# Altium project R100.230.030.000-00 ControlVR.PrjPcb (part 1 of 2)
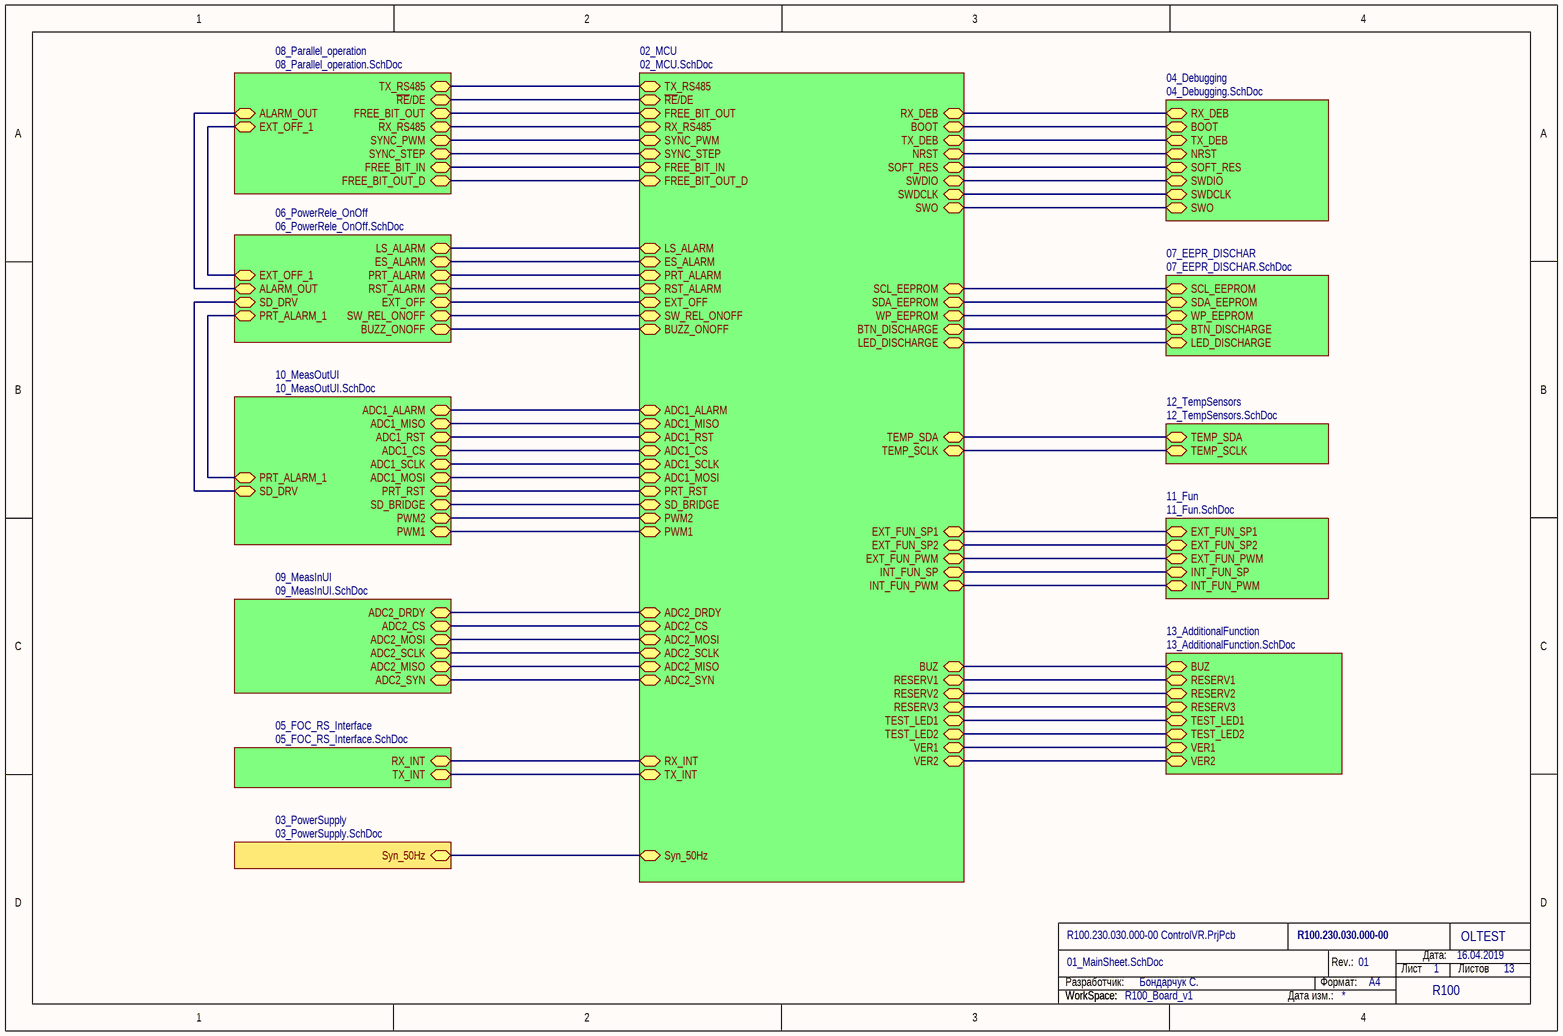
[diagram p0: 01_MainSheet.SchDoc]
13 sheets, 497 parts. Net scope: hierarchical (ports join the sheet entries above them; power ports are global).
Board file: R100.230.030.001-00 ControlVR.PcbDoc
Sheets:
  01_MainSheet.SchDoc
    02_MCU = 02_MCU.SchDoc
    03_PowerSupply = 03_PowerSupply.SchDoc
    04_Debugging = 04_Debugging.SchDoc
    05_FOC_RS_Interface = 05_FOC_RS_Interface.SchDoc
    06_PowerRele_OnOff = 06_PowerRele_OnOff.SchDoc
    07_EEPR_DISCHAR = 07_EEPR_DISCHAR.SchDoc
    08_Parallel_operation = 08_Parallel_operation.SchDoc
    09_MeasInUI = 09_MeasInUI.SchDoc
    10_MeasOutUI = 10_MeasOutUI.SchDoc
    11_Fun = 11_Fun.SchDoc
    12_TempSensors = 12_TempSensors.SchDoc
    13_AdditionalFunction = 13_AdditionalFunction.SchDoc

## Sheet 01_MainSheet.SchDoc
size A4; Organization: OLTEST; Revision: 01; SheetNumber: 1; SheetTotal: 13; Название листа: Название листа; Разработчик: Бондарчук С.; Прибор: R100; АМАК.000000.000 Э3: R100.230.030.000-00; Дата: 16.04.2019; Формат: A4; WorkspaceName: R100_Board_v1; PageSetup: Record=PageOptions|CenterHorizontal=True|CenterVertical=True|PrintScale=0.97|XCorrection=1.00|YCorrection=1.00|PrintKind=0|BorderSize=5000000|LeftOffset=0|BottomOffset=0|Orientation=2|PaperLength=1000|PaperWidth=1000|Scale=100|PaperSource=7|PrintQuality=-3|MediaType=1|DitherType=10|PrintScaleMode=1|PaperKind=A4|PaperIndex=9

### Sub-sheets
02_MCU = 02_MCU.SchDoc: SWO, SOFT_RES, TX_INT, PRT_ALARM, WP_EEPROM, SWDCLK, TX_RS485, LS_ALARM, SCL_EEPROM, SW_REL_ONOFF, ES_ALARM, NRST, RST_ALARM, RX_INT, RX_DEB, Syn_50Hz, BOOT, SDA_EEPROM, SWDIO, TX_DEB, SYNC_PWM, INT_FUN_SP, ADC1_MISO, TEMP_SDA, VER2, LED_DISCHARGE, RX_RS485, ADC1_MOSI, ADC2_MOSI, EXT_FUN_SP2, ADC1_ALARM, FREE_BIT_IN, VER1, ADC2_CS, TEST_LED2, BUZ, ADC1_RST, ADC2_SYN, SD_BRIDGE, ADC1_SCLK, TEST_LED1, PWM1, BUZZ_ONOFF, ADC2_SCLK, EXT_FUN_SP1, ADC1_CS, BTN_DISCHARGE, RESERV2, EXT_OFF, PWM2, ADC2_MISO, RESERV1, EXT_FUN_PWM, TEMP_SCLK, PRT_RST, RESERV3, FREE_BIT_OUT, ~{RE}/DE, INT_FUN_PWM, ADC2_DRDY, SYNC_STEP, FREE_BIT_OUT_D
03_PowerSupply = 03_PowerSupply.SchDoc: Syn_50Hz
04_Debugging = 04_Debugging.SchDoc: SWDIO, TX_DEB, RX_DEB, SWO, SWDCLK, BOOT, SOFT_RES, NRST
05_FOC_RS_Interface = 05_FOC_RS_Interface.SchDoc: RX_INT, TX_INT
06_PowerRele_OnOff = 06_PowerRele_OnOff.SchDoc: PRT_ALARM_1, LS_ALARM, ES_ALARM, PRT_ALARM, RST_ALARM, SW_REL_ONOFF, ALARM_OUT, BUZZ_ONOFF, EXT_OFF, SD_DRV, EXT_OFF_1
07_EEPR_DISCHAR = 07_EEPR_DISCHAR.SchDoc: SCL_EEPROM, SDA_EEPROM, WP_EEPROM, BTN_DISCHARGE, LED_DISCHARGE
08_Parallel_operation = 08_Parallel_operation.SchDoc: ~{RE}/DE, FREE_BIT_OUT, TX_RS485, ALARM_OUT, RX_RS485, SYNC_PWM, SYNC_STEP, FREE_BIT_IN, EXT_OFF_1, FREE_BIT_OUT_D
09_MeasInUI = 09_MeasInUI.SchDoc: ADC2_CS, ADC2_MOSI, ADC2_DRDY, ADC2_SCLK, ADC2_MISO, ADC2_SYN
10_MeasOutUI = 10_MeasOutUI.SchDoc: SD_BRIDGE, ADC1_RST, ADC1_ALARM, PRT_RST, ADC1_MISO, PRT_ALARM_1, ADC1_SCLK, ADC1_CS, ADC1_MOSI, PWM2, PWM1, SD_DRV
11_Fun = 11_Fun.SchDoc: EXT_FUN_PWM, EXT_FUN_SP1, EXT_FUN_SP2, INT_FUN_SP, INT_FUN_PWM
12_TempSensors = 12_TempSensors.SchDoc: TEMP_SCLK, TEMP_SDA
13_AdditionalFunction = 13_AdditionalFunction.SchDoc: RESERV3, RESERV2, VER2, BUZ, RESERV1, VER1, TEST_LED1, TEST_LED2

### Nets
~{RE}/DE: sheet 02_MCU/~{RE}/DE, sheet 08_Parallel_operation/~{RE}/DE
ADC1_ALARM: sheet 02_MCU/ADC1_ALARM, sheet 10_MeasOutUI/ADC1_ALARM
ADC1_CS: sheet 02_MCU/ADC1_CS, sheet 10_MeasOutUI/ADC1_CS
ADC1_MISO: sheet 02_MCU/ADC1_MISO, sheet 10_MeasOutUI/ADC1_MISO
ADC1_MOSI: sheet 02_MCU/ADC1_MOSI, sheet 10_MeasOutUI/ADC1_MOSI
ADC1_RST: sheet 02_MCU/ADC1_RST, sheet 10_MeasOutUI/ADC1_RST
ADC1_SCLK: sheet 02_MCU/ADC1_SCLK, sheet 10_MeasOutUI/ADC1_SCLK
ADC2_CS: sheet 02_MCU/ADC2_CS, sheet 09_MeasInUI/ADC2_CS
ADC2_DRDY: sheet 02_MCU/ADC2_DRDY, sheet 09_MeasInUI/ADC2_DRDY
ADC2_MISO: sheet 02_MCU/ADC2_MISO, sheet 09_MeasInUI/ADC2_MISO
ADC2_MOSI: sheet 02_MCU/ADC2_MOSI, sheet 09_MeasInUI/ADC2_MOSI
ADC2_SCLK: sheet 02_MCU/ADC2_SCLK, sheet 09_MeasInUI/ADC2_SCLK
ADC2_SYN: sheet 02_MCU/ADC2_SYN, sheet 09_MeasInUI/ADC2_SYN
ALARM_OUT: sheet 06_PowerRele_OnOff/ALARM_OUT, sheet 08_Parallel_operation/ALARM_OUT
BOOT: sheet 02_MCU/BOOT, sheet 04_Debugging/BOOT
BTN_DISCHARGE: sheet 02_MCU/BTN_DISCHARGE, sheet 07_EEPR_DISCHAR/BTN_DISCHARGE
BUZ: sheet 02_MCU/BUZ, sheet 13_AdditionalFunction/BUZ
BUZZ_ONOFF: sheet 02_MCU/BUZZ_ONOFF, sheet 06_PowerRele_OnOff/BUZZ_ONOFF
ES_ALARM: sheet 02_MCU/ES_ALARM, sheet 06_PowerRele_OnOff/ES_ALARM
EXT_FUN_PWM: sheet 02_MCU/EXT_FUN_PWM, sheet 11_Fun/EXT_FUN_PWM
EXT_FUN_SP1: sheet 02_MCU/EXT_FUN_SP1, sheet 11_Fun/EXT_FUN_SP1
EXT_FUN_SP2: sheet 02_MCU/EXT_FUN_SP2, sheet 11_Fun/EXT_FUN_SP2
EXT_OFF: sheet 02_MCU/EXT_OFF, sheet 06_PowerRele_OnOff/EXT_OFF
EXT_OFF_1: sheet 06_PowerRele_OnOff/EXT_OFF_1, sheet 08_Parallel_operation/EXT_OFF_1
FREE_BIT_IN: sheet 02_MCU/FREE_BIT_IN, sheet 08_Parallel_operation/FREE_BIT_IN
FREE_BIT_OUT: sheet 02_MCU/FREE_BIT_OUT, sheet 08_Parallel_operation/FREE_BIT_OUT
FREE_BIT_OUT_D: sheet 02_MCU/FREE_BIT_OUT_D, sheet 08_Parallel_operation/FREE_BIT_OUT_D
INT_FUN_PWM: sheet 02_MCU/INT_FUN_PWM, sheet 11_Fun/INT_FUN_PWM
INT_FUN_SP: sheet 02_MCU/INT_FUN_SP, sheet 11_Fun/INT_FUN_SP
LED_DISCHARGE: sheet 02_MCU/LED_DISCHARGE, sheet 07_EEPR_DISCHAR/LED_DISCHARGE
LS_ALARM: sheet 02_MCU/LS_ALARM, sheet 06_PowerRele_OnOff/LS_ALARM
NRST: sheet 02_MCU/NRST, sheet 04_Debugging/NRST
PRT_ALARM: sheet 02_MCU/PRT_ALARM, sheet 06_PowerRele_OnOff/PRT_ALARM
PRT_ALARM_1: sheet 06_PowerRele_OnOff/PRT_ALARM_1, sheet 10_MeasOutUI/PRT_ALARM_1
PRT_RST: sheet 02_MCU/PRT_RST, sheet 10_MeasOutUI/PRT_RST
PWM1: sheet 02_MCU/PWM1, sheet 10_MeasOutUI/PWM1
PWM2: sheet 02_MCU/PWM2, sheet 10_MeasOutUI/PWM2
RESERV1: sheet 02_MCU/RESERV1, sheet 13_AdditionalFunction/RESERV1
RESERV2: sheet 02_MCU/RESERV2, sheet 13_AdditionalFunction/RESERV2
RESERV3: sheet 02_MCU/RESERV3, sheet 13_AdditionalFunction/RESERV3
RST_ALARM: sheet 02_MCU/RST_ALARM, sheet 06_PowerRele_OnOff/RST_ALARM
RX_DEB: sheet 02_MCU/RX_DEB, sheet 04_Debugging/RX_DEB
RX_INT: sheet 02_MCU/RX_INT, sheet 05_FOC_RS_Interface/RX_INT
RX_RS485: sheet 02_MCU/RX_RS485, sheet 08_Parallel_operation/RX_RS485
SCL_EEPROM: sheet 02_MCU/SCL_EEPROM, sheet 07_EEPR_DISCHAR/SCL_EEPROM
SD_BRIDGE: sheet 02_MCU/SD_BRIDGE, sheet 10_MeasOutUI/SD_BRIDGE
SD_DRV: sheet 06_PowerRele_OnOff/SD_DRV, sheet 10_MeasOutUI/SD_DRV
SDA_EEPROM: sheet 02_MCU/SDA_EEPROM, sheet 07_EEPR_DISCHAR/SDA_EEPROM
SOFT_RES: sheet 02_MCU/SOFT_RES, sheet 04_Debugging/SOFT_RES
SW_REL_ONOFF: sheet 02_MCU/SW_REL_ONOFF, sheet 06_PowerRele_OnOff/SW_REL_ONOFF
SWDCLK: sheet 02_MCU/SWDCLK, sheet 04_Debugging/SWDCLK
SWDIO: sheet 02_MCU/SWDIO, sheet 04_Debugging/SWDIO
SWO: sheet 02_MCU/SWO, sheet 04_Debugging/SWO
Syn_50Hz: sheet 02_MCU/Syn_50Hz, sheet 03_PowerSupply/Syn_50Hz
SYNC_PWM: sheet 02_MCU/SYNC_PWM, sheet 08_Parallel_operation/SYNC_PWM
SYNC_STEP: sheet 02_MCU/SYNC_STEP, sheet 08_Parallel_operation/SYNC_STEP
TEMP_SCLK: sheet 02_MCU/TEMP_SCLK, sheet 12_TempSensors/TEMP_SCLK
TEMP_SDA: sheet 02_MCU/TEMP_SDA, sheet 12_TempSensors/TEMP_SDA
TEST_LED1: sheet 02_MCU/TEST_LED1, sheet 13_AdditionalFunction/TEST_LED1
TEST_LED2: sheet 02_MCU/TEST_LED2, sheet 13_AdditionalFunction/TEST_LED2
TX_DEB: sheet 02_MCU/TX_DEB, sheet 04_Debugging/TX_DEB
TX_INT: sheet 02_MCU/TX_INT, sheet 05_FOC_RS_Interface/TX_INT
TX_RS485: sheet 02_MCU/TX_RS485, sheet 08_Parallel_operation/TX_RS485
VER1: sheet 02_MCU/VER1, sheet 13_AdditionalFunction/VER1
VER2: sheet 02_MCU/VER2, sheet 13_AdditionalFunction/VER2
WP_EEPROM: sheet 02_MCU/WP_EEPROM, sheet 07_EEPR_DISCHAR/WP_EEPROM

### Notes on the sheet
- Разработчик:
- Формат:
- Rev.:
- Лист
- Дата:
- Листов
- WorkSpace:
- Дата изм.:

## Sheet 02_MCU.SchDoc
size A4; Organization: OLTEST; Revision: 01; SheetNumber: 2; SheetTotal: 13; Название листа: Название листа; Разработчик: Бондарчук С.; Прибор: R100; АМАК.000000.000 Э3: R100.230.030.000-00; Дата: 16.04.2019; Формат: A4; WorkspaceName: R100_Boards_v1
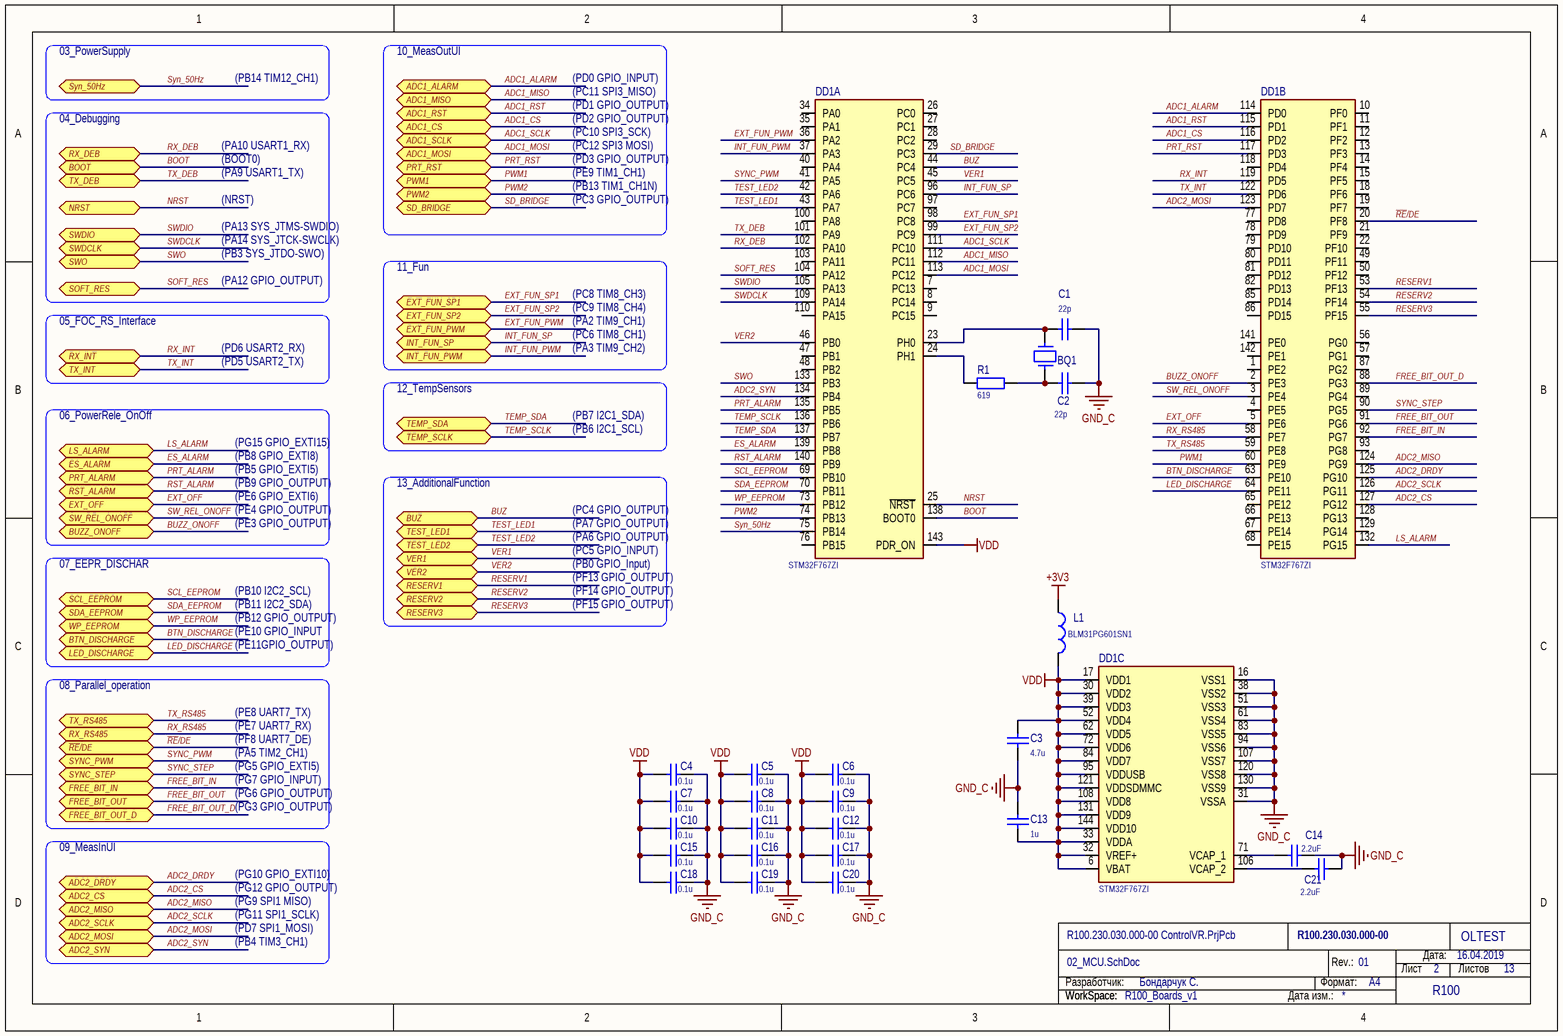
[diagram p1: 02_MCU.SchDoc]

### Parts
BQ1  12MHz  [DFN390P500X135-2N]  (value not drawn)
C1  22р  [SMD_C_0603]
C2  22р  [SMD_C_0603]
C3  4.7u  [SMD_C_0805]
C4  0.1u  [SMD_C_0603]
C5  0.1u  [SMD_C_0603]
C6  0.1u  [SMD_C_0603]
C7  0.1u  [SMD_C_0603]
C8  0.1u  [SMD_C_0603]
C9  0.1u  [SMD_C_0603]
C10  0.1u  [SMD_C_0603]
C11  0.1u  [SMD_C_0603]
C12  0.1u  [SMD_C_0603]
C13  1u  [SMD_C_0603]
C14  2.2uF  [SMD_C_0805]
C15  0.1u  [SMD_C_0603]
C16  0.1u  [SMD_C_0603]
C17  0.1u  [SMD_C_0603]
C18  0.1u  [SMD_C_0603]
C19  0.1u  [SMD_C_0603]
C20  0.1u  [SMD_C_0603]
C21  2.2uF  [SMD_C_0805]
DD1  STM32F767ZI  [SOT486-1_V]  (parts A,B,C of 3)
L1  BLM31PG601SN1  [SMD_L_1206]
R1  619  [SMD_R_0603]

### Ports
ADC1_ALARM, ADC1_CS, ADC1_MISO, ADC1_MOSI, ADC1_RST, ADC1_SCLK, ADC2_CS, ADC2_DRDY, ADC2_MISO, ADC2_MOSI, ADC2_SCLK, ADC2_SYN, BOOT, BTN_DISCHARGE, BUZ, BUZZ_ONOFF, ES_ALARM, EXT_FUN_PWM, EXT_FUN_SP1, EXT_FUN_SP2, EXT_OFF, FREE_BIT_IN, FREE_BIT_OUT, FREE_BIT_OUT_D, INT_FUN_PWM, INT_FUN_SP, LED_DISCHARGE, LS_ALARM, NRST, PRT_ALARM, PRT_RST, PWM1, PWM2, RESERV1, RESERV2, RESERV3, RST_ALARM, RX_DEB, RX_INT, RX_RS485, SCL_EEPROM, SD_BRIDGE, SDA_EEPROM, SOFT_RES, SW_REL_ONOFF, SWDCLK, SWDIO, SWO, Syn_50Hz, SYNC_PWM, SYNC_STEP, TEMP_SCLK, TEMP_SDA, TEST_LED1, TEST_LED2, TX_DEB, TX_INT, TX_RS485, VER1, VER2, WP_EEPROM, ~{RE}/DE

### Nets
+3V3: L1.1
GND_C: C1.2 C2.2 C3.1 C4.2 C5.2 C6.2 C7.2 C8.2 C9.2 C10.2 C11.2 C12.2 C13.2 C14.2 C15.2 C16.2 C17.2 C18.2 C19.2 C20.2 C21.2 DD1.16(VSS1) DD1.31(VSSA) DD1.38(VSS2) DD1.51(VSS3) DD1.61(VSS4) DD1.83(VSS5) DD1.94(VSS6) DD1.107(VSS7) DD1.120(VSS8) DD1.130(VSS9)
VDD: C3.2 C4.1 C5.1 C6.1 C7.1 C8.1 C9.1 C10.1 C11.1 C12.1 C13.1 C15.1 C16.1 C17.1 C18.1 C19.1 C20.1 DD1.6(VBAT) DD1.17(VDD1) DD1.30(VDD2) DD1.32(VREF+) DD1.33(VDDA) DD1.39(VDD3) DD1.52(VDD4) DD1.62(VDD5) DD1.72(VDD6) DD1.84(VDD7) DD1.95(VDDUSB) DD1.108(VDD8) DD1.121(VDDSDMMC) DD1.131(VDD9) DD1.143(PDR_ON) DD1.144(VDD10) L1.2
~{RE}/DE: DD1.20(PF8) ; port ~{RE}/DE
ADC1_ALARM: DD1.114(PD0) ; port ADC1_ALARM
ADC1_CS: DD1.116(PD2) ; port ADC1_CS
ADC1_MISO: DD1.112(PC11) ; port ADC1_MISO
ADC1_MOSI: DD1.113(PC12) ; port ADC1_MOSI
ADC1_RST: DD1.115(PD1) ; port ADC1_RST
ADC1_SCLK: DD1.111(PC10) ; port ADC1_SCLK
ADC2_CS: DD1.127(PG12) ; port ADC2_CS
ADC2_DRDY: DD1.125(PG10) ; port ADC2_DRDY
ADC2_MISO: DD1.124(PG9) ; port ADC2_MISO
ADC2_MOSI: DD1.123(PD7) ; port ADC2_MOSI
ADC2_SCLK: DD1.126(PG11) ; port ADC2_SCLK
ADC2_SYN: DD1.134(PB4) ; port ADC2_SYN
BOOT: DD1.138(BOOT0) ; port BOOT
BTN_DISCHARGE: DD1.63(PE10) ; port BTN_DISCHARGE
BUZ: DD1.44(PC4) ; port BUZ
BUZZ_ONOFF: DD1.2(PE3) ; port BUZZ_ONOFF
ES_ALARM: DD1.139(PB8) ; port ES_ALARM
EXT_FUN_PWM: DD1.36(PA2) ; port EXT_FUN_PWM
EXT_FUN_SP1: DD1.98(PC8) ; port EXT_FUN_SP1
EXT_FUN_SP2: DD1.99(PC9) ; port EXT_FUN_SP2
EXT_OFF: DD1.5(PE6) ; port EXT_OFF
FREE_BIT_IN: DD1.92(PG7) ; port FREE_BIT_IN
FREE_BIT_OUT: DD1.91(PG6) ; port FREE_BIT_OUT
FREE_BIT_OUT_D: DD1.88(PG3) ; port FREE_BIT_OUT_D
INT_FUN_PWM: DD1.37(PA3) ; port INT_FUN_PWM
INT_FUN_SP: DD1.96(PC6) ; port INT_FUN_SP
LED_DISCHARGE: DD1.64(PE11) ; port LED_DISCHARGE
LS_ALARM: DD1.132(PG15) ; port LS_ALARM
NRST: DD1.25(~{NRST}) ; port NRST
PRT_ALARM: DD1.135(PB5) ; port PRT_ALARM
PRT_RST: DD1.117(PD3) ; port PRT_RST
PWM1: DD1.60(PE9) ; port PWM1
PWM2: DD1.74(PB13) ; port PWM2
RESERV1: DD1.53(PF13) ; port RESERV1
RESERV2: DD1.54(PF14) ; port RESERV2
RESERV3: DD1.55(PF15) ; port RESERV3
RST_ALARM: DD1.140(PB9) ; port RST_ALARM
RX_DEB: DD1.102(PA10) ; port RX_DEB
RX_INT: DD1.119(PD5) ; port RX_INT
RX_RS485: DD1.58(PE7) ; port RX_RS485
SCL_EEPROM: DD1.69(PB10) ; port SCL_EEPROM
SD_BRIDGE: DD1.29(PC3) ; port SD_BRIDGE
SDA_EEPROM: DD1.70(PB11) ; port SDA_EEPROM
SOFT_RES: DD1.104(PA12) ; port SOFT_RES
SW_REL_ONOFF: DD1.3(PE4) ; port SW_REL_ONOFF
SWDCLK: DD1.109(PA14) ; port SWDCLK
SWDIO: DD1.105(PA13) ; port SWDIO
SWO: DD1.133(PB3) ; port SWO
Syn_50Hz: DD1.75(PB14) ; port Syn_50Hz
SYNC_PWM: DD1.41(PA5) ; port SYNC_PWM
SYNC_STEP: DD1.90(PG5) ; port SYNC_STEP
TEMP_SCLK: DD1.136(PB6) ; port TEMP_SCLK
TEMP_SDA: DD1.137(PB7) ; port TEMP_SDA
TEST_LED1: DD1.43(PA7) ; port TEST_LED1
TEST_LED2: DD1.42(PA6) ; port TEST_LED2
TX_DEB: DD1.101(PA9) ; port TX_DEB
TX_INT: DD1.122(PD6) ; port TX_INT
TX_RS485: DD1.59(PE8) ; port TX_RS485
VER1: DD1.45(PC5) ; port VER1
VER2: DD1.46(PB0) ; port VER2
WP_EEPROM: DD1.73(PB12) ; port WP_EEPROM
NetBQ1_1: BQ1.1 C2.1 R1.2
NetBQ1_2: BQ1.2 C1.1 DD1.23(PH0)
NetC14_1: C14.1 DD1.71(VCAP_1)
NetC21_1: C21.1 DD1.106(VCAP_2)
NetDD1_24: DD1.24(PH1) R1.1

Not connected (* = marked no-connect by the designer): DD1 1(PE2) 4(PE5) 7(PC13) 8(PC14) 9(PC15) 10(PF0) 11(PF1) 12(PF2) 13(PF3) 14(PF4) 15(PF5) 18(PF6) 19(PF7) 21(PF9) 22(PF10) 26(PC0) 27(PC1) 28(PC2) 34(PA0) 35(PA1) 40(PA4) 47(PB1) 48(PB2) 49(PF11) 50(PF12) 56(PG0) 57(PG1) 65(PE12) 66(PE13) 67(PE14) 68(PE15) 76(PB15) 77(PD8) 78(PD9) 79(PD10) 80(PD11) 81(PD12) 82(PD13) 85(PD14) 86(PD15) 87(PG2) 89(PG4) 93(PG8) 97(PC7) 100(PA8) 103(PA11) 110(PA15) 118(PD4) 128(PG13) 129(PG14) 141(PE0) 142(PE1)

### Notes on the sheet
- 03_PowerSupply
- (PB14 TIM12_CH1)
- 10_MeasOutUI
- (PC11 SPI3_MISO)
- (PD0 GPIO_INPUT)
- (PD1 GPIO_OUTPUT)
- 04_Debugging
- (PA10 USART1_RX)
- (BOOT0)
- (PA9 USART1_TX)
- (PC10 SPI3_SCK)
- (PC12 SPI3 MOSI)
- (PE9 TIM1_CH1)
- (PD2 GPIO_OUTPUT)
- (PD3 GPIO_OUTPUT)
- (NRST)
- (PA13 SYS_JTMS-SWDIO)
- (PA14 SYS_JTCK-SWCLK)
- (PB13 TIM1_CH1N)
- (PС3 GPIO_OUTPUT)
- (PB3 SYS_JTDO-SWO)
- (PA12 GPIO_OUTPUT)
- 11_Fun
- (PC8 TIM8_CH3)
- (PC9 TIM8_CH4)
- 05_FOC_RS_Interface
- (PD5 USART2_TX)
- (PD6 USART2_RX)
- (PC6 TIM8_CH1)
- (PA2 TIM9_CH1)
- (PA3 TIM9_CH2)
- 06_PowerRele_OnOff
- (PG15 GPIO_EXTI15)
- 12_TempSensors
- (PB7 I2C1_SDA)
- (PB6 I2C1_SCL)
- (PB8 GPIO_EXTI8)
- (PB5 GPIO_EXTI5)
- (PE6 GPIO_EXTI6)
- (PB9 GPIO_OUTPUT)
- (PE4 GPIO_OUTPUT)
- 13_AdditionalFunction
- (PC4 GPIO_OUTPUT)
- 07_EEPR_DISCHAR
- (PE3 GPIO_OUTPUT)
- (PA7 GPIO_OUTPUT)
- (PA6 GPIO_OUTPUT)
- (PC5 GPIO_INPUT)
- (PB0 GPIO_Input)
- (PF13 GPIO_OUTPUT)
- (PB10 I2C2_SCL)
- (PB11 I2C2_SDA)
- (PB12 GPIO_OUTPUT)
- (PE10 GPIO_INPUT
- (PE11GPIO_OUTPUT)
- (PF14 GPIO_OUTPUT)
- (PF15 GPIO_OUTPUT)
- 08_Parallel_operation
- (PE8 UART7_TX)
- (PE7 UART7_RX)
- (PF8 UART7_DE)
- (PA5 TIM2_CH1)
- (PG5 GPIO_EXTI5)
- (PG7 GPIO_INPUT)
- 09_MeasInUI
- (PG6 GPIO_OUTPUT)
- (PG3 GPIO_OUTPUT)
- (PG9 SPI1 MISO)
- (PG11 SPI1_SCLK)
- (PG10 GPIO_EXTI10)
- (PG12 GPIO_OUTPUT)
- (PD7 SPI1_MOSI)
- (PB4 TIM3_CH1)
- Разработчик:
- Формат:
- Rev.:
- Лист
- Дата:
- Листов
- WorkSpace:
- Дата изм.:

### Library data of the parts
BQ1 = 7A-12.000MAAJ-T: 12MHz Quartz Crystal 7A; Manufacturer: TXC; PartNumber: 7A-12.000MAAJ-T; Value: 12MHz
C1 C2 = C0603 22p 50V 5%: SMD C 0603 MURATA 50V 5% C0G; PartNumber: GRM1885C1H220JA01; Manufacturer: MURATA; Value: 22р
C3 = C0805 4.7u 25V 20%  X5R: SMD C 0805 MURATA 50V 5% NP0; PartNumber: GRM21BR61E475M; Manufacturer: MURATA; Value: 4.7u
C4-C12 C15-C20 = C0603 0.1u 50V 10%: SMD C 0603 MURATA 50V 10% X7R; PartNumber: GRM188R71H104K; Manufacturer: MURATA; Value: 0.1u
C13 = C0603 1uF 25V 10%: SMD C 0603 MURATA 25V 10% X7R; PartNumber: GRM188R71E105KA12; Manufacturer: MURATA; Value: 1u
C14 C21 = C0805 2.2u 25V 10% X7R: SMD C 0805 MURATA 25V 10% X7R; PartNumber: GRM21BR61H225M; Manufacturer: MURATA; Value: 2.2uF
DD1 = STM32F767ZI: 32-bit ARM Cortex-M7 MCU+FPU; Manufactorer: ST; PartNumber: STM32F767ZI
L1 = BLM31PG601SN1: 600R 1.5A (100MHz); Manufacturer: TDK; Value: 600R 1.5A (100MHz); PartNumber: BLM31PG601SN1
R1 = R0603 619 1%: SMD 0603 VISHAY 0.1W 75V 1% 100ppm; PartNumber: CRCW0603619RFK; Manufacturer: VISHAY; Value: 619

## Sheet 03_PowerSupply.SchDoc
size A4; Organization: OLTEST; Revision: 1; SheetNumber: 3; SheetTotal: 13; Название листа: Название листа; Разработчик: Бондарчук С.; Прибор: R100; АМАК.000000.000 Э3: R100.230.030.000-00; Дата: 16.04.2019; Формат: A4; WorkspaceName: R100_Boards_v1
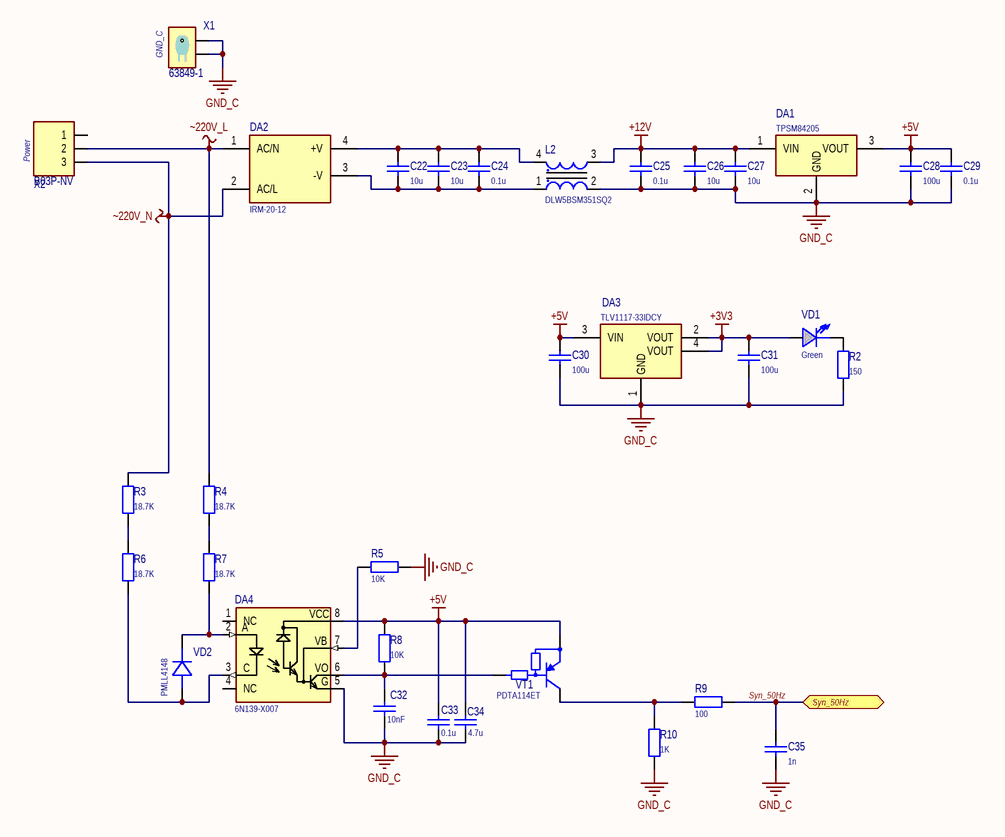
[diagram p2: 03_PowerSupply.SchDoc]

### Parts
C22  10u  [SMD_C_1206]
C23  10u  [SMD_C_1206]
C24  0.1u  [SMD_C_0603]
C25  0.1u  [SMD_C_0603]
C26  10u  [SMD_C_1206]
C27  10u  [SMD_C_1206]
C28  100u  [SMD_C_0805]
C29  0.1u  [SMD_C_0603]
C30  100u  [SMD_C_0805]
C31  100u  [SMD_C_0805]
C32  10nF  [SMD_C_0603]
C33  0.1u  [SMD_C_0603]
C34  4.7u  [SMD_C_0805]
C35  1n  [SMD_C_0603]
DA1  TPSM84205  [EAB (SIP DCDC Module)]
DA2  IRM-20-12  [IRM-20-12]
DA3  TLV1117-33IDCY  [SOT-223_M]
DA4  6N139-X007  [6N139-X007]
L2  DLW5BSM351SQ2  [DLW5BS(AH)]
R2  150  [SMD_R_0805]
R3  18.7K  [SMD_R_1206]
R4  18.7K  [SMD_R_1206]
R5  10K  [SMD_R_0603]
R6  18.7K  [SMD_R_1206]
R7  18.7K  [SMD_R_1206]
R8  10K  [SMD_R_0805]
R9  100  [SMD_R_0603]
R10  1K  [SMD_R_0603]
VD1  value Green  [SMD_LED_LL_Green]  (hidden comment: LL-S172GC-2A)
VD2  PMLL4148  [SOD80C]
VT1  PDTA114ET  [SOT23-3]
X1  63849-1  [63849-1]
X2  B03P-NV  [B03P-NV (power)]

### Ports
Syn_50Hz

### Nets
+3V3: C31.1 DA3.2(VOUT) DA3.4(VOUT) VD1.1(ANODE)
+5V: C28.1 C29.2 C30.1 C33.2 C34.2 DA1.3(VOUT) DA3.3(VIN) DA4.8(VCC) R8.2 VT1.2(E)
+12V: C25.2 C26.2 C27.2 DA1.1(VIN) L2.3
GND_C: C25.1 C26.1 C27.1 C28.2 C29.1 C30.2 C31.2 C32.1 C33.1 C34.1 C35.1 DA1.2(GND) DA3.1(GND) DA4.5 L2.2 R2.1 R5.2 R10.1 X1.1 X1.2
~220V_L: DA2.1(AC/N) R4.2 X2.2
~220V_N: DA2.2(AC/L) R3.2 X2.3
Syn_50Hz: C35.2 R9.2 ; port Syn_50Hz
NetC22_1: C22.1 C23.1 C24.1 DA2.3(-V) L2.1
NetC22_2: C22.2 C23.2 C24.2 DA2.4(+V) L2.4
NetC32_2: C32.2 DA4.6 R8.1 VT1.1(B)
NetDA4_2: DA4.2 R7.1 VD2.2(CATHODE)
NetDA4_3: DA4.3(C) R6.1 VD2.1(ANODE)
NetDA4_7: DA4.7(VB) R5.1
NetR2_2: R2.2 VD1.2(CATHODE)
NetR3_1: R3.1 R6.2
NetR4_1: R4.1 R7.2
NetR9_1: R9.1 R10.2 VT1.3(C)

Not connected (* = marked no-connect by the designer): DA4 1(NC) 4(NC); X2 1

### Notes on the sheet
- (near X1) GND_C
- (near X2) Power
- Разработчик:
- Формат:
- Rev.:
- Лист
- Дата:
- Листов
- WorkSpace:
- Дата изм.:
- (in symbol 6N139-X007) A; VO; G

### Library data of the parts
C22 C23 C26 C27 = C1206 10u 25V 20%: SMD C 1206 MURATA 25V 20% X5R; PartNumber: GRM31MR61E106M; Manufacturer: MURATA; Value: 10u
C24 C25 C29 C33 = C0603 0.1u 50V 10%: as C4 on sheet 02_MCU; Manufacturer: MURATA; Value: 0.1u
C28 C30 C31 = C0805 100u 6.3V 20% X5R: SMD 0805 MURATA 6.3V 20% X5R; PartNumber: GRM21BR60J107M; Manufacturer: MURATA; Value: 100u
C32 = C0603 10nF 100V 10%: SMD C 0603 MURATA 100V 10% X7R; PartNumber: GRJ188R72A103KE11#; Manufacturer: MURATA; Value: 10nF
C34 = C0805 4.7u 25V 20%  X5R: as C3 on sheet 02_MCU; Manufacturer: MURATA; Value: 4.7u
C35 = C0603 1n 50V 5%: SMD C 0603 MURATA 50V 5% NP0; PartNumber: GRM1885C1H102JA01; Manufacturer: MURATA; Value: 1n
DA1 = TPSM84205: 1.5A 5Vout up to 28 Vin StepDown module; Manufacturer: Texas Instrument; PartNumber: TPSM84205
DA2 = IRM-20-12: 20W 12VDC 1.85A PCB; Manufacturer: Mean Well; PartNumber: IRM-20-12
DA3 = TLV1117-33IDCY: Voltage regulator 3.3V 800mA; Manufacturer: Texas Instrument; PartNumber: TLV1117-33IDCY
DA4 = 6N139-X007: Optocoupler darlingron 5.3kV 100 kbit/s; Manufacturer: Vishay; PartNumber: 6N139-X007
L2 = DLW5BSM351SQ2: SMD Common Mode Choke Coil 2A Z = 350 Ohm / 100 MHz; Manufacturer: MURATA; PartNumber: DLW5BSM351SQ2
R2 = R0805 150 1%: SMD 0805 VISHAY 0.125W 150V 1% 100ppm; PartNumber: CRCW0805150RFK; Manufacturer: VISHAY; Value: 150
R3 R4 R6 R7 = R1206 18.7K 1%: SMD R 1206 VISHAY 0.25W 200V 1% 100ppm; PartNumber: CRCW120618K7FK; Manufacturer: VISHAY; Value: 18.7K
R5 = R0603 10К 1%: SMD R 0603 VISHAY 0.1W 75V 1% 100ppm; PartNumber: CRCW060310K0FK; Manufacturer: VISHAY; Value: 10K
R8 = R0805 10K 1%: SMD R 0805 VISHAY 0.125W 150V 1% 100ppm; PartNumber: CRCW080510K0FK; Manufacturer: VISHAY; Value: 10K
R9 = R0603 100 1%: SMD R 0603 VISHAY 0.1W 75V 1% 100ppm; PartNumber: CRCW0603100RFK; Manufacturer: VISHAY; Value: 100
R10 = R0603 1K 1%: SMD R 0603 VISHAY 0.1W 75V 1% 100ppm; PartNumber: CRCW06031K00FK; Manufacturer: VISHAY; Value: 1K
VD1 = LL-S172GC-2A: LED Green SMD; Manufacturer: Lucky Light; PartNumber: LL-S172GC-2A
VD2 = PMLL4148: If=0.2A, Vf=1V Vrrm=100V Diode (SOD80C); Manufacturer: NXP Semiconductors; PartNumber: PMLL4148
VT1 = PDTA114ET: Digital Transistor (BRT), R1=10 kOhm, R2=10 kOhm, PNP Transistor; Manufacturer: NXP; PartNumber: PDTA114ET
X1 = 63849-1: PCB, 6.3х0.8, hole; Manufacturer: TE Connectivity; PartNumber: 63849-1
X2 = B03P-NV: NV 3 конт LS=5.0 10A 250V PCB; Manufacturer: JST; PartNumber: B03P-NV

## Sheet 04_Debugging.SchDoc
size A4; Organization: OLTEST; Revision: 01; SheetNumber: 4; SheetTotal: 13; Название листа: Название листа; Разработчик: Бондарчук С.; Прибор: R100; АМАК.000000.000 Э3: R100.230.030.000-00; Дата: 16.04.2019; Формат: A4; WorkspaceName: R100_Boards_v1
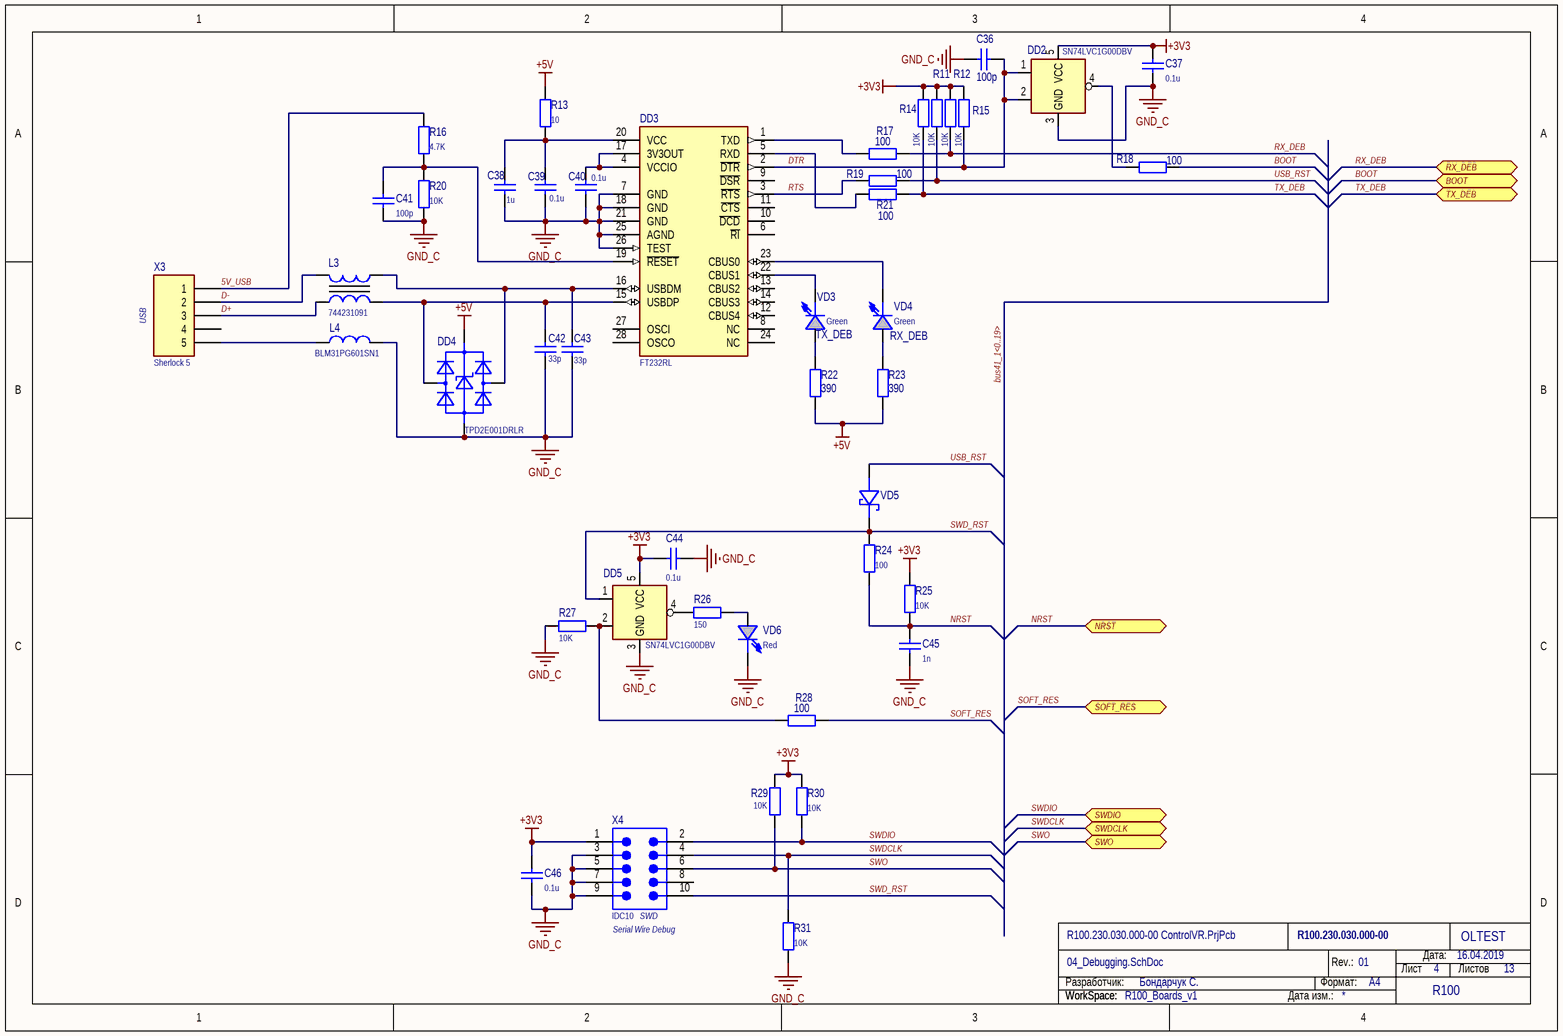
[diagram p3: 04_Debugging.SchDoc]

### Parts
C36  100p  [SMD_C_0603]
C37  0.1u  [SMD_C_0603]
C38  1u  [SMD_C_0603]
C39  0.1u  [SMD_C_0603]
C40  0.1u  [SMD_C_0603]
C41  100p  [SMD_C_0603]
C42  33p  [SMD_C_0603]
C43  33p  [SMD_C_0603]
C44  0.1u  [SMD_C_0603]
C45  1n  [SMD_C_0603]
C46  0.1u  [SMD_C_0603]
DD2  SN74LVC1G00DBV  [SOT-23(DBV)]
DD3  FT232RL  [SSOP-28_M]
DD4  TPD2E001DRLR  [DRL5_M]
DD5  SN74LVC1G00DBV  [SOT-23(DBV)]
L3  744231091  [WE-CNSW-0805]
L4  BLM31PG601SN1  [SMD_L_1206]
R11  10K  [SMD_R_0603]
R12  10K  [SMD_R_0603]
R13  10  [SMD_R_0805]
R14  10K  [SMD_R_0603]
R15  10K  [SMD_R_0603]
R16  4.7K  [SMD_R_0805]
R17  100  [SMD_R_0603]
R18  100  [SMD_R_0603]
R19  100  [SMD_R_0603]
R20  10K  [SMD_R_0805]
R21  100  [SMD_R_0603]
R22  390  [SMD_R_0805]
R23  390  [SMD_R_0805]
R24  100  [SMD_R_0603]
R25  10K  [SMD_R_0603]
R26  150  [SMD_R_0805]
R27  10K  [SMD_R_0603]
R28  100  [SMD_R_0603]
R29  10K  [SMD_R_0603]
R30  10K  [SMD_R_0603]
R31  10K  [SMD_R_0603]
VD3  value Green  [SMD_LED_LL_Green]  (hidden comment: LL-S172GC-2A)
VD4  value Green  [SMD_LED_LL_Green]  (hidden comment: LL-S172GC-2A)
VD5  MBR0540T1G  [SOD-123]  (value not drawn)
VD6  value Red  [SMD_LED_LL_Red]  (hidden comment: LL-S172SC-2S)
X3  Sherlock 5  [35362-0550]
X4  IDC10  [918510x324]

### Ports
BOOT, NRST, RX_DEB, SOFT_RES, SWDCLK, SWDIO, SWO, TX_DEB

### Nets
+3V3: C37.1 C44.2 C46.2 DD2.5(VCC) DD5.5(VCC) R11.2 R12.2 R14.2 R15.2 R25.2 R29.2 R30.2 X4.1
+5V: DD4.1(VCC) R13.2 R22.1 R23.1
GND_C: C36.2 C37.2 C38.1 C39.1 C40.1 C41.1 C42.2 C43.2 C44.1 C45.1 C46.1 DD2.3(GND) DD3.7(GND) DD3.18(GND) DD3.21(GND) DD3.25(AGND) DD3.26(TEST) DD4.4(GND) DD5.3(GND) L4.2 R20.1 R27.2 R31.1 VD6.2(CATHODE) X4.3 X4.5 X4.7 X4.9
5V_USB: R16.2 X3.1
BOOT: R18.2 ; port BOOT
D+: L3.1 X3.3
D-: L3.4 X3.2
DTR: C36.1 DD2.1 DD2.2 DD3.2(~{DTR}) R15.1
NRST: C45.2 R24.1 R25.1 ; port NRST
RTS: DD3.3(~{RTS}) R19.1
RX_DEB: R12.1 R17.2 ; port RX_DEB
SOFT_RES: R28.2 ; port SOFT_RES
SWD_RST: DD5.1 R24.2 VD5.1(Cathode) X4.10
SWDCLK: R31.2 X4.4 ; port SWDCLK
SWDIO: R30.1 X4.2 ; port SWDIO
SWO: R29.1 X4.6 ; port SWO
TX_DEB: R14.1 R21.2 ; port TX_DEB
USB_RST: R11.1 R19.2 VD5.2(Anode)
NetC38_2: C38.2 C39.2 DD3.20(VCC) R13.1
NetC40_2: C40.2 DD3.4(VCCIO) DD3.17(3V3OUT)
NetC41_2: C41.2 DD3.19(~{RESET}) R16.1 R20.2
NetC42_1: C42.1 DD3.15(USBDP) DD4.3(IO1) L3.2
NetC43_1: C43.1 DD3.16(USBDM) DD4.5(IO2) L3.3
NetDD2_4: DD2.4 R18.1
NetDD3_1: DD3.1(TXD) R17.1
NetDD3_5: DD3.5(RXD) R21.1
NetDD3_22: DD3.22(CBUS1) VD3.2(CATHODE)
NetDD3_23: DD3.23(CBUS0) VD4.2(CATHODE)
NetDD5_2: DD5.2 R27.1 R28.1
NetDD5_4: DD5.4 R26.1
NetL4_1: L4.1 X3.5
NetR22_2: R22.2 VD3.1(ANODE)
NetR23_2: R23.2 VD4.1(ANODE)
NetR26_2: R26.2 VD6.1(ANODE)

Not connected (* = marked no-connect by the designer): DD3 6(~{RI}) 8(NC) 9(~{DSR}) 10(~{DCD}) 11(~{CTS}) 12(CBUS4) 13(CBUS2) 14(CBUS3) 24(NC) 27(OSCI) 28(OSCO); X3 4; X4 8

### Buses and harness runs
bus bus41_1<0..19>

### Notes on the sheet
- (near X3) USB
- (near VD3) TX_DEB
- (near VD4) RX_DEB
- (near X4) SWD
- (near X4) Serial Wire Debug
- Разработчик:
- Формат:
- Rev.:
- Лист
- Дата:
- Листов
- WorkSpace:
- Дата изм.:
- (in symbol SN74LVC1G00DBV) &

### Library data of the parts
C36 C41 = C0603 100p 100V 5%: SMD C 0603 MURATA 100V 5% NP0; PartNumber: GRM1885C2A101JA01; Manufacturer: MURATA; Value: 100p
C37 C39 C40 C44 C46 = C0603 0.1u 50V 10%: as C4 on sheet 02_MCU; Manufacturer: MURATA; Value: 0.1u
C38 = C0603 1uF 25V 10%: as C13 on sheet 02_MCU; Manufacturer: MURATA; Value: 1u
C42 C43 = C0603 33p 50V 5%: SMD C 0603 MURATA 50V 5% NP0; PartNumber: GRM1885C1H330JA01; Manufacturer: MURATA; Value: 33p
C45 = C0603 1n 50V 5%: as C35 on sheet 03_PowerSupply; Manufacturer: MURATA; Value: 1n
DD2 DD5 = SN74LVC1G00DBV: 2-in NAND; Manufacturer: Texas Instruments; PartNumber: SN74LVC1G00DBV
DD3 = FT232RL: USB UART Asynchronous Serial Data Transfer Chip, 28-pin SSOP; Manufacturer: FTDI; PartNumber: FT232RL
DD4 = TPD2E001DRLR: Low-Capacitance + / - 15 kV ESD-Protection Array for High-Speed Data Interfaces, 2 Channels, -40 to +85 degC, 5-pin SOT (DRL), Green (RoHS & no Sb/Br); Manufacturer: Texas Instruments; PartNumber: TPD2E001DRLR
L3 = 744231091: SMD Common Mode Noise Suppressor WE-CNSW, Z = 90 Ohm; Manufacturer: Wurth Elektronik; Impedance: 90 Ohm; DatasheetVersion: ver 4, Nov-2010; PackageReference: WE-CNSW-0805; PackageDescription: SMD Inductor, 4-Leads, Body 1.4 x 2.2 mm; PartNumber: 744231091
L4 = BLM31PG601SN1: 600R 1.5A (100MHz); Manufacturer: TDK; Value: 600R 1.5A (100MHz); PartNumber: BLM31PG601SN1
R11 R12 R14 R15 R25 R27 R29-R31 = R0603 10К 1%: as R5 on sheet 03_PowerSupply; Manufacturer: VISHAY; Value: 10K
R13 = R0805 10 1%: SMD R 0805 VISHAY 0.125W 150V 1% 100ppm; PartNumber: CRCW080510R0FK; Manufacturer: VISHAY; Value: 10
R16 = R0805 4.7K 1%: SMD R 0805 VISHAY 0.125W 150V 1% 100ppm; PartNumber: CRCW08054K70FK; Manufacturer: VISHAY; Value: 4.7K
R17-R19 R21 R24 R28 = R0603 100 1%: as R9 on sheet 03_PowerSupply; Manufacturer: VISHAY; Value: 100
R20 = R0805 10K 1%: as R8 on sheet 03_PowerSupply; Manufacturer: VISHAY; Value: 10K
R22 R23 = R0805 390R 1%: SMD R 0805 VISHAY 0.125W 150V 1% 100ppm; PartNumber: CRCW0805390RFK; Manufacturer: VISHAY; Value: 390
R26 = R0805 150 1%: as R2 on sheet 03_PowerSupply; Manufacturer: VISHAY; Value: 150
VD3 VD4 = LL-S172GC-2A: LED Green SMD; Manufacturer: Lucky Light; PartNumber: LL-S172GC-2A
VD5 = MBR0540T1G: 0.5A/40V Schottky Diode (SOD-123); Manufacturer: ON Semiconductor; PartNumber: MBR0540T1G
VD6 = LL-S172SC-2S: LED Red SMD; Manufacturer: Lucky Light; PartNumber: LL-S172SC-2S
X3 = 35362-0550: Sherlock 5 Top, 2A 125V 2mm; Manufacturer: MOLEX; PartNumber: 35362-0550
X4 = Harting IDC10 904: Flat Cable Connector (IDC), Standard Male Header, Straight Solder Pin, 10 Contacts, Long Levers, Performance Level 2; PartNumber: 09 18 510 6904; PCB_Layout: Complies with manufacturer's recommendation.; DrillSize: Corresponds to nominal value.; Published: 15-Nov-2004; DatasheetDocument: Sep-2003; PackageDocument: Jun-2000; PackageReference: 918510x904; Publisher: Altium Limited; ComponentLink1Description: Manufacturer Link; ComponentLink1URL: http://www.harting.com/; ComponentLink2Description: Selection Guide; ComponentLink2URL: http://www.harting.com/imperia/md/content/steckverbinderundsystemkomponenten/folder/interface_engl_chapter_09.pdf

## Sheet 05_FOC_RS_Interface.SchDoc
size A4; Organization: OLTEST; Revision: 01; SheetNumber: 5; SheetTotal: 13; Название листа: Название листа; Разработчик: Бондарчук С.; Прибор: R100; АМАК.000000.000 Э3: R100.230.030.000-00; Дата: 16.04.2019; Формат: A4; WorkspaceName: R100_Boards_v1
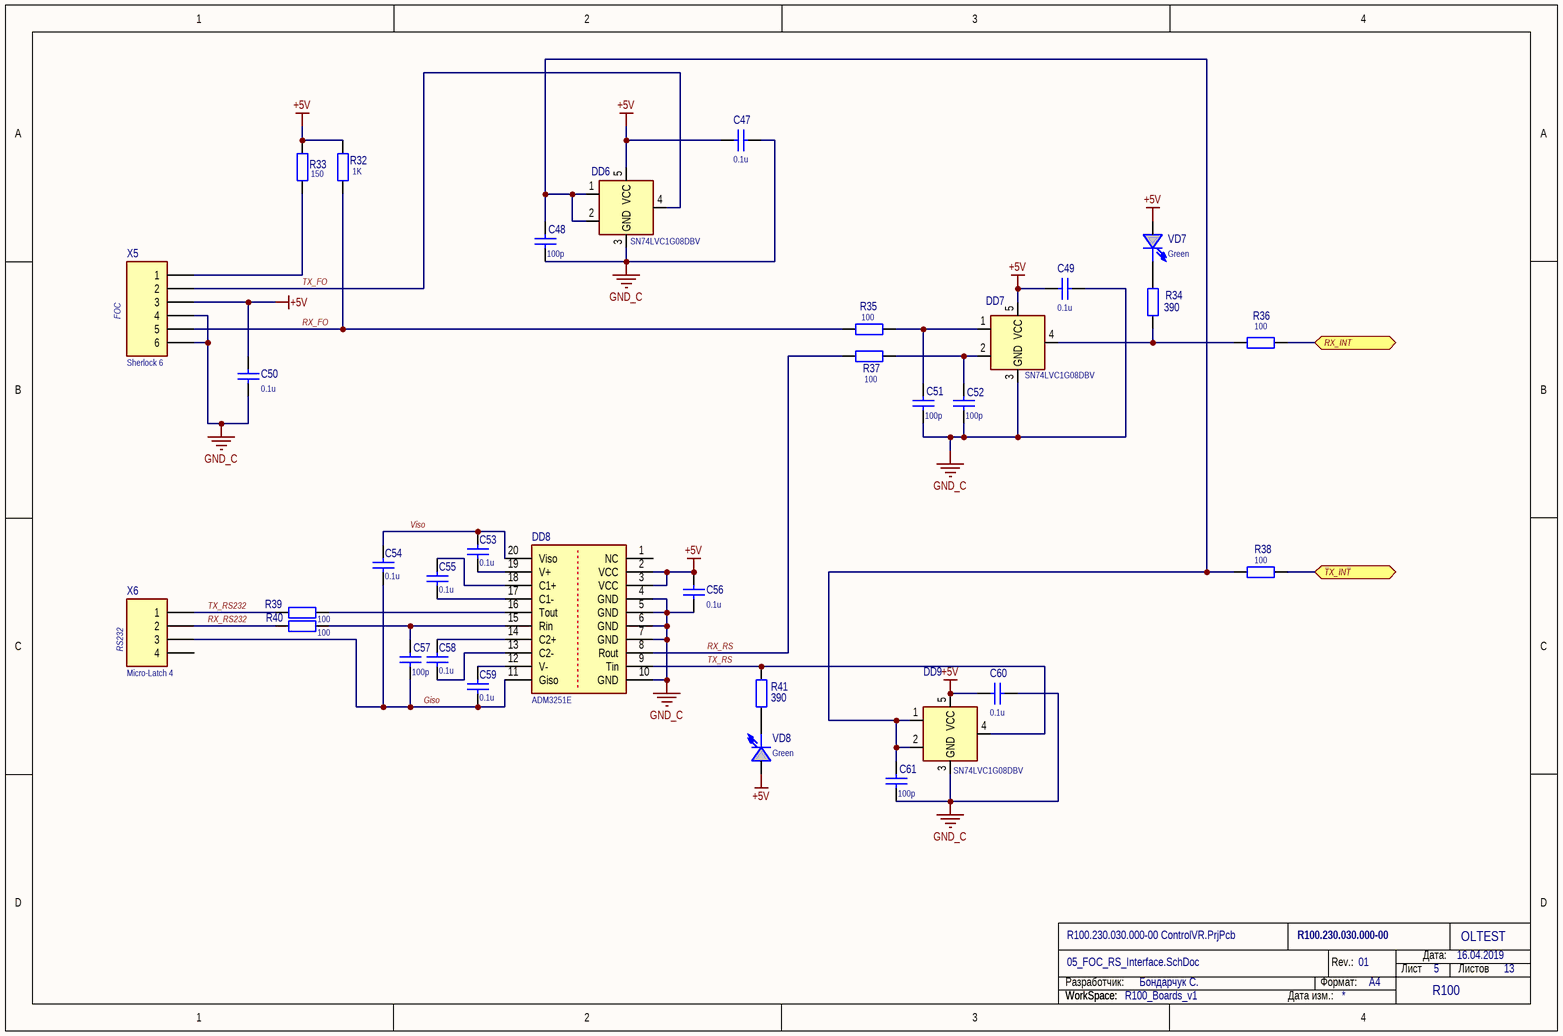
[diagram p4: 05_FOC_RS_Interface.SchDoc]

### Parts
C47  0.1u  [SMD_C_0603]
C48  100p  [SMD_C_0603]
C49  0.1u  [SMD_C_0603]
C50  0.1u  [SMD_C_0603]
C51  100p  [SMD_C_0603]
C52  100p  [SMD_C_0603]
C53  0.1u  [SMD_C_0603]
C54  0.1u  [SMD_C_0603]
C55  0.1u  [SMD_C_0603]
C56  0.1u  [SMD_C_0603]
C57  100p  [SMD_C_0603]
C58  0.1u  [SMD_C_0603]
C59  0.1u  [SMD_C_0603]
C60  0.1u  [SMD_C_0603]
C61  100p  [SMD_C_0603]
DD6  SN74LVC1G08DBV  [SOT-23(DBV)]
DD7  SN74LVC1G08DBV  [SOT-23(DBV)]
DD8  ADM3251E  [RW-20]
DD9  SN74LVC1G08DBV  [SOT-23(DBV)]
R32  1K  [SMD_R_0603]
R33  150  [SMD_R_0805]
R34  390  [SMD_R_0805]
R35  100  [SMD_R_0603]
R36  100  [SMD_R_0603]
R37  100  [SMD_R_0603]
R38  100  [SMD_R_0603]
R39  100  [SMD_R_0603]
R40  100  [SMD_R_0603]
R41  390  [SMD_R_0805]
VD7  value Green  [SMD_LED_LL_Green]  (hidden comment: LL-S172GC-2A)
VD8  value Green  [SMD_LED_LL_Green]  (hidden comment: LL-S172GC-2A)
X5  Sherlock 6  [35362-0650]
X6  Micro-Latch 4  [53253-0470]

### Ports
RX_INT, TX_INT

### Nets
+5V: C47.1 C49.1 C50.2 C56.2 C60.1 DD6.5(VCC) DD7.5(VCC) DD8.2(VCC) DD8.3(VCC) DD9.5(VCC) R32.2 R33.2 VD7.1(ANODE) VD8.1(ANODE) X5.3
GND_C: C47.2 C48.1 C49.2 C50.1 C51.1 C52.2 C56.1 C60.2 C61.1 DD6.3(GND) DD7.3(GND) DD8.4(GND) DD8.5(GND) DD8.6(GND) DD8.7(GND) DD8.10(GND) DD9.3(GND) X5.4 X5.6
Giso: C54.1 C57.1 C59.1 DD8.11(Giso) X6.3
RX_FO: R32.1 R35.1 X5.5
RX_INT: R36.2 ; port RX_INT
RX_RS: DD8.8(Rout) R37.1
RX_RS232: R40.1 X6.2
TX_FO: DD6.4 X5.2
TX_INT: R38.2 ; port TX_INT
TX_RS: DD8.9(Tin) DD9.4 R41.2
TX_RS232: R39.1 X6.1
Viso: C53.2 C54.2 DD8.20(Viso)
NetC48_2: C48.2 C61.2 DD6.1 DD6.2 DD9.1 DD9.2 R38.1
NetC51_2: C51.2 DD7.1 R35.2
NetC52_1: C52.1 DD7.2 R37.2
NetC53_1: C53.1 DD8.19(V+)
NetC55_1: C55.1 DD8.17(C1-)
NetC55_2: C55.2 DD8.18(C1+)
NetC57_2: C57.2 DD8.15(Rin) R40.2
NetC58_1: C58.1 DD8.13(C2-)
NetC58_2: C58.2 DD8.14(C2+)
NetC59_2: C59.2 DD8.12(V-)
NetDD7_4: DD7.4 R34.1 R36.1
NetDD8_16: DD8.16(Tout) R39.2
NetR33_1: R33.1 X5.1
NetR34_2: R34.2 VD7.2(CATHODE)
NetR41_1: R41.1 VD8.2(CATHODE)

Not connected (* = marked no-connect by the designer): DD8 1(NC); X6 4

### Notes on the sheet
- (near X5) FOC
- (near X6) RS232
- Разработчик:
- Формат:
- Rev.:
- Лист
- Дата:
- Листов
- WorkSpace:
- Дата изм.:
- (in symbol SN74LVC1G08DBV) &

### Library data of the parts
C47 C49 C50 C53-C56 C58-C60 = C0603 0.1u 50V 10%: as C4 on sheet 02_MCU; Manufacturer: MURATA; Value: 0.1u
C48 C51 C52 C57 C61 = C0603 100p 100V 5%: as C36 on sheet 04_Debugging; Manufacturer: MURATA; Value: 100p
DD6 DD7 DD9 = SN74LVC1G08DBV: 2-in AND; Manufacturer: Texas Instruments; PartNumber: SN74LVC1G08DBV
DD8 = ADM3251E: Isolated, Single-Channel, RS-232 Line Driver/Receiver; Manufacturer: Analog Device; PartNumber: ADM3251EARWZ
R32 = R0603 1K 1%: as R10 on sheet 03_PowerSupply; Manufacturer: VISHAY; Value: 1K
R33 = R0805 150 1%: as R2 on sheet 03_PowerSupply; Manufacturer: VISHAY; Value: 150
R34 R41 = R0805 390R 1%: as R22 on sheet 04_Debugging; Manufacturer: VISHAY; Value: 390
R35-R40 = R0603 100 1%: as R9 on sheet 03_PowerSupply; Manufacturer: VISHAY; Value: 100
VD7 VD8 = LL-S172GC-2A: LED Green SMD; Manufacturer: Lucky Light; PartNumber: LL-S172GC-2A
X5 = 35363-0650: Sherlock 6 Side, 2A 125V 2mm; Manufacturer: MOLEX; PartNumber: 35362-0650
X6 = 53253-0470: Micro-Latch 4  LS=2 2A 125V PCB; Manufacturer: MOLEX; PartNumber: 53253-0470

## Sheet 06_PowerRele_OnOff.SchDoc
size A4; Organization: OLTEST; Revision: 01; SheetNumber: 6; SheetTotal: 13; Название листа: Название листа; Разработчик: Бондарчук С.; Прибор: R100; АМАК.000000.000 Э3: R100.230.030.000-00; Дата: 16.04.2019; Формат: A4; Workspacename: R100_Boards_v1; PageSetup: Record=PageOptions|CenterHorizontal=True|CenterVertical=True|PrintScale=0.97|XCorrection=1.00|YCorrection=1.00|PrintKind=0|BorderSize=5000000|LeftOffset=0|BottomOffset=0|Orientation=2|PaperLength=1000|PaperWidth=1000|Scale=100|PaperSource=7|PrintQuality=-3|MediaType=1|DitherType=10|PrintScaleMode=1|PaperKind=A4|PaperIndex=9
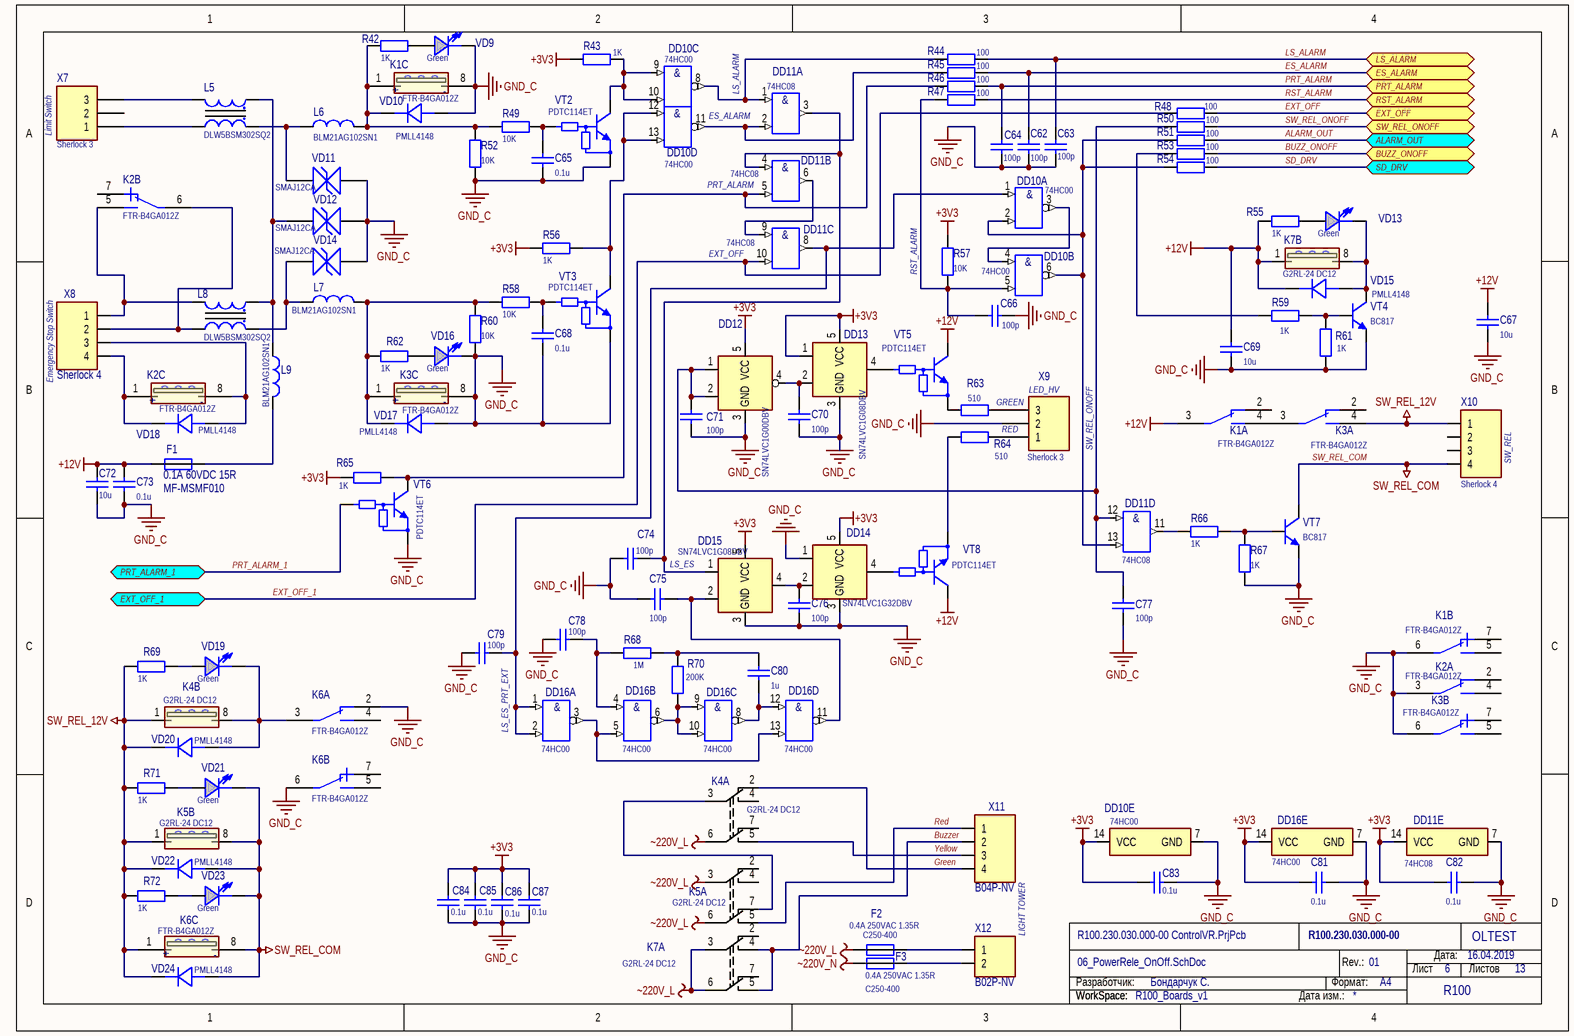
[diagram p5: 06_PowerRele_OnOff.SchDoc]

### Parts
C62  100p  [SMD_C_0603]
C63  100p  [SMD_C_0603]
C64  100p  [SMD_C_0603]
C65  0.1u  [SMD_C_0603]
C66  100p  [SMD_C_0603]
C67  10u  [SMD_C_1206]
C68  0.1u  [SMD_C_0603]
C69  10u  [SMD_C_1206]
C70  100p  [SMD_C_0603]
C71  100p  [SMD_C_0603]
C72  10u  [SMD_C_1206]
C73  0.1u  [SMD_C_0603]
C74  100p  [SMD_C_0603]
C75  100p  [SMD_C_0603]
C76  100p  [SMD_C_0603]
C77  100p  [SMD_C_0603]
C78  100p  [SMD_C_0603]
C79  100p  [SMD_C_0603]
C80  1u  [SMD_C_0603]
C81  0.1u  [SMD_C_0603]
C82  0.1u  [SMD_C_0603]
C83  0.1u  [SMD_C_0603]
C84  0.1u  [SMD_C_0603]
C85  0.1u  [SMD_C_0603]
C86  0.1u  [SMD_C_0603]
C87  0.1u  [SMD_C_0603]
DD10  74HC00  [TSSOP14]  (parts A,B,C,D,E of 5)
DD11  74HC08  [TSSOP14]  (parts A,B,C,D,E of 5)
DD12  SN74LVC1G00DBV  [SOT-23(DBV)]
DD13  SN74LVC1G08DBV  [SOT-23(DBV)]
DD14  SN74LVC1G32DBV  [SOT-23(DBV)]
DD15  SN74LVC1G08DBV  [SOT-23(DBV)]
DD16  74HC00  [TSSOP14]  (parts A,B,C,D,E of 5)
F1  0.1A 60VDC 15R  [MF-MSMF010]
F2  0.4A 250VAC 1.35R  [C250-400]
F3  0.4A 250VAC 1.35R  [C250-400]
K1  FTR-B4GA012Z  [FTR-B4GA]  (parts A,B,C of 3)
K2  FTR-B4GA012Z  [FTR-B4GA]  (parts A,B,C of 3)
K3  FTR-B4GA012Z  [FTR-B4GA]  (parts A,B,C of 3)
K4  G2RL-24 DC12  [G2RL]  (parts A,B of 2)
K5  G2RL-24 DC12  [G2RL]  (parts A,B of 2)
K6  FTR-B4GA012Z  [FTR-B4GA]  (parts A,B,C of 3)
K7  G2RL-24 DC12  [G2RL]  (parts A,B of 2)
L5  DLW5BSM302SQ2  [DLW5BS(AH)]
L6  BLM21AG102SN1  [SMD_L_L2_W1.25]
L7  BLM21AG102SN1  [SMD_L_L2_W1.25]
L8  DLW5BSM302SQ2  [DLW5BS(AH)]
L9  BLM21AG102SN1  [SMD_L_L2_W1.25]
R42  1K  [SMD_R_1206]
R43  1K  [SMD_R_0603]
R44  100  [SMD_R_0603]
R45  100  [SMD_R_0603]
R46  100  [SMD_R_0603]
R47  100  [SMD_R_0603]
R48  100  [SMD_R_0603]
R49  10K  [SMD_R_0603]
R50  100  [SMD_R_0603]
R51  100  [SMD_R_0603]
R52  10K  [SMD_R_0603]
R53  100  [SMD_R_0603]
R54  100  [SMD_R_0603]
R55  1K  [SMD_R_1206]
R56  1K  [SMD_R_0603]
R57  10K  [SMD_R_0603]
R58  10K  [SMD_R_0603]
R59  1K  [SMD_R_0805]
R60  10K  [SMD_R_0603]
R61  1K  [SMD_R_0805]
R62  1K  [SMD_R_1206]
R63  510  [SMD_R_1206]
R64  510  [SMD_R_1206]
R65  1K  [SMD_R_0603]
R66  1K  [SMD_R_0805]
R67  1K  [SMD_R_0805]
R68  1M  [SMD_R_0805]
R69  1K  [SMD_R_1206]
R70  200K  [SMD_R_0805]
R71  1K  [SMD_R_1206]
R72  1K  [SMD_R_1206]
VD9  value Green  [SMD_LED_LL_Green]  (hidden comment: LL-S172GC-2A)
VD10  PMLL4148  [SOD80C]
VD11  SMAJ12CA  [DO-214AC noPolarity]
VD12  SMAJ12CA  [DO-214AC noPolarity]
VD13  value Green  [SMD_LED_LL_Green]  (hidden comment: LL-S172GC-2A)
VD14  SMAJ12CA  [DO-214AC noPolarity]
VD15  PMLL4148  [SOD80C]
VD16  value Green  [SMD_LED_LL_Green]  (hidden comment: LL-S172GC-2A)
VD17  PMLL4148  [SOD80C]
VD18  PMLL4148  [SOD80C]
VD19  value Green  [SMD_LED_LL_Green]  (hidden comment: LL-S172GC-2A)
VD20  PMLL4148  [SOD80C]
VD21  value Green  [SMD_LED_LL_Green]  (hidden comment: LL-S172GC-2A)
VD22  PMLL4148  [SOD80C]
VD23  value Green  [SMD_LED_LL_Green]  (hidden comment: LL-S172GC-2A)
VD24  PMLL4148  [SOD80C]
VT2  PDTC114ET  [SOT23-3]
VT3  PDTC114ET  [SOT23-3]
VT4  BC817  [SOT23-3]
VT5  PDTC114ET  [SOT23-3]
VT6  PDTC114ET  [SOT23-3]
VT7  BC817  [SOT23-3]
VT8  PDTC114ET  [SOT23-3]
X7  Sherlock 3  [35362-0350]
X8  Sherlock 4  [35362-0450]
X9  Sherlock 3  [35362-0350]
X10  Sherlock 4  [35362-0450]
X11  B04P-NV  [B04P-NV (power)]
X12  B02P-NV  [B02P-NV]

### Ports
ALARM_OUT, BUZZ_ONOFF, ES_ALARM, EXT_OFF, EXT_OFF_1, LS_ALARM, PRT_ALARM, PRT_ALARM_1, RST_ALARM, SD_DRV (bidir), SW_REL_ONOFF

### Nets
+3V3: C81.1 C82.1 C83.1 C84.2 C85.2 C86.2 C87.2 DD10.14(VCC) DD11.14(VCC) DD12.5(VCC) DD13.1 DD13.5(VCC) DD14.5(VCC) DD15.5(VCC) DD16.14(VCC) R43.2 R56.2 R57.1 R65.2
+12V: C67.2 C69.2 C72.2 C73.2 F1.1 K1.3 K7.1 R55.1 VD15.2(CATHODE) VT5.3(C) VT8.3(C)
GND_C: C62.1 C63.1 C64.1 C65.1 C66.1 C67.1 C68.1 C69.1 C70.2 C71.1 C72.1 C73.1 C74.2 C75.2 C76.2 C77.2 C78.2 C79.2 C81.2 C82.2 C83.2 C84.1 C85.1 C86.1 C87.1 DD10.7(GND) DD11.7(GND) DD12.3(GND) DD13.3(GND) DD14.1 DD14.3(GND) DD15.3(GND) DD16.7(GND) K1.6 K1.8 K2.3 K3.6 K3.8 K6.2 K6.6 R52.1 R60.1 R61.1 R67.1 VD9.2(CATHODE) VD10.1(ANODE) VD11.2 VD12.2 VD14.2 VD16.2(CATHODE) VD17.1(ANODE) VT2.2(E) VT3.2(E) VT4.2(E) VT6.2(E) VT7.2(E) X9.2
SW_REL_12V: K3.4 K4.1 K5.1 K6.1 R69.1 R71.1 R72.1 VD20.2(CATHODE) VD22.2(CATHODE) VD24.2(CATHODE) X10.1
SW_REL_COM: K5.8 K6.8 VD21.2(CATHODE) VD22.1(ANODE) VD23.2(CATHODE) VD24.1(ANODE) VT7.3(C) X10.4
~220V_L: F2.1 K4.6 K5.3 K5.6 K7.3 K7.6
~220V_N: F3.1
ALARM_OUT: R51.2 ; port ALARM_OUT
BUZZ_ONOFF: R53.2 ; port BUZZ_ONOFF
Buzzer: K7.4 K7.5 X11.2
ES_ALARM: C62.2 R45.2 ; port ES_ALARM
EXT_OFF: R48.2 ; port EXT_OFF
EXT_OFF_1: DD11.10(3B) R48.1 ; port EXT_OFF_1
Green: K4.2 X11.4
LS_ALARM: C63.2 R44.2 ; port LS_ALARM
PRT_ALARM: C64.2 R46.2 ; port PRT_ALARM
PRT_ALARM_1: VT6.1(B) ; port PRT_ALARM_1
Red: K5.5 X11.1
RST_ALARM: R47.2 ; port RST_ALARM
SD_DRV: R54.2 ; port SD_DRV
SW_REL_ONOFF: R50.2 ; port SW_REL_ONOFF
Yellow: K4.5 X11.3
NetC65_2: C65.2 R49.2 VT2.1(B)
NetC66_2: C66.2 DD10.5(2B) R47.1 R57.2
NetC68_2: C68.2 R58.2 VT3.1(B)
NetC70_1: C70.1 DD12.4 DD13.2
NetC71_2: C71.2 C77.1 DD11.12(4A) DD12.1 DD12.2 R50.1
NetC74_1: C74.1 DD11.3(1Y) DD11.4(2A) DD15.1
NetC75_1: C75.1 DD15.2 DD16.11(4Y)
NetC76_1: C76.1 DD14.2 DD15.4
NetC78_1: C78.1 DD16.4(2A) R68.1
NetC79_1: C79.1 DD10.1(1A) DD11.8(3Y) DD16.1(1A) DD16.2(1B)
NetC80_1: C80.1 DD16.8(3Y) DD16.12(4A)
NetC80_2: C80.2 R68.2 R70.2
NetDD10_2: DD10.2(1B) DD10.6(2Y) DD11.13(4B) R51.1 R54.1
NetDD10_3: DD10.3(1Y) DD10.4(2A)
NetDD10_8: DD10.8(3Y) DD11.1(1A) R44.1
NetDD10_9: DD10.9(3A) DD10.10(3B) R43.1 VT2.3(C)
NetDD10_11: DD10.11(4Y) DD11.2(1B) R45.1
NetDD10_12: DD10.12(4A) DD10.13(4B) R56.1 VT3.3(C)
NetDD11_5: DD11.5(2B) R46.1 R65.1 VT6.3(C)
NetDD11_6: DD11.6(2Y) DD11.9(3A)
NetDD11_11: DD11.11(4Y) R66.1
NetDD13_4: DD13.4 VT5.1(B)
NetDD14_4: DD14.4 VT8.1(B)
NetDD16_3: DD16.3(1Y) DD16.5(2B) DD16.13(4B)
NetDD16_6: DD16.6(2Y) DD16.9(3A) DD16.10(3B) R70.1
NetF1_2: F1.2 L9.2
NetF2_2: F2.2 X12.1
NetF3_2: F3.2 X12.2
NetK1_1: K1.1 L6.2 R42.1 R49.1 R52.2 VD10.2(CATHODE)
NetK1_4: K1.4 K3.3
NetK2_1: K2.1 VD18.2(CATHODE) X8.4
NetK2_5: K2.5 L8.2 X8.1
NetK2_6: K2.6 L8.3 X8.2
NetK2_8: K2.8 VD18.1(ANODE) X8.3
NetK3_1: K3.1 L7.2 R58.1 R60.2 R62.1 VD17.2(CATHODE)
NetK4_3: K4.3 K5.7
NetK4_8: K4.8 K6.3 VD19.2(CATHODE) VD20.1(ANODE)
NetK7_8: K7.8 VD13.2(CATHODE) VD15.1(ANODE) VT4.3(C)
NetL5_1: L5.1 L6.1 VD11.1
NetL5_2: L5.2 X7.1
NetL5_3: L5.3 X7.3
NetL5_4: L5.4 L8.1 L9.1 VD12.1
NetL7_1: L7.1 L8.4 VD14.1
NetR42_2: R42.2 VD9.1(ANODE)
NetR53_1: R53.1 R59.1
NetR55_2: R55.2 VD13.1(ANODE)
NetR59_2: R59.2 R61.2 VT4.1(B)
NetR62_2: R62.2 VD16.1(ANODE)
NetR63_1: R63.1 VT5.2(E)
NetR63_2: R63.2 X9.3
NetR64_1: R64.1 VT8.2(E)
NetR64_2: R64.2 X9.1
NetR66_2: R66.2 R67.2 VT7.1(B)
NetR69_2: R69.2 VD19.1(ANODE)
NetR71_2: R71.2 VD21.1(ANODE)
NetR72_2: R72.2 VD23.1(ANODE)

Not connected (* = marked no-connect by the designer): K1 2 5 7; K2 2 4 7; K3 2 5 7; K4 4 7; K5 2 4; K6 4 5 7; K7 2 7; X7 2; X10 2 3

### Notes on the sheet
- LS_ALARM
- (near X7) Limit Switch
- (near DD10) ES_ALARM
- (near DD11) PRT_ALARM
- (near DD11) EXT_OFF
- (near R57) RST_ALARM
- (near X8) Emergency Stop Switch
- GREEN
- RED
- (near X9) LED_HV
- SW_REL_ONOFF
- (near X10) SW_REL
- LS_ES
- LS_ES_PRT_EXT
- LIGHT TOWER
- Разработчик:
- Формат:
- Rev.:
- Лист
- Дата:
- Листов
- WorkSpace:
- Дата изм.:
- (in symbol 74HC00, part A) &
- (in symbol 74HC00, part B) &
- (in symbol 74HC00, part C) &
- (in symbol 74HC00, part D) &
- (in symbol 74HC08, part A) &
- (in symbol 74HC08, part B) &
- (in symbol 74HC08, part C) &
- (in symbol 74HC08, part D) &
- (in symbol FTR-B4GA012Z, part C) -; +
- (in symbol SN74LVC1G00DBV) &
- (in symbol SN74LVC1G08DBV) &

### Library data of the parts
C62-C64 C66 C70 C71 C74-C79 = C0603 100p 100V 5%: as C36 on sheet 04_Debugging; Manufacturer: MURATA; Value: 100p
C65 C68 C73 C81-C87 = C0603 0.1u 50V 10%: as C4 on sheet 02_MCU; Manufacturer: MURATA; Value: 0.1u
C67 C69 C72 = C1206 10u 25V 20%: as C22 on sheet 03_PowerSupply; Manufacturer: MURATA; Value: 10u
C80 = C0603 1uF 25V 10%: as C13 on sheet 02_MCU; Manufacturer: MURATA; Value: 1u
DD10 DD16 = 74HC00: Quad 2-Input Positive-NAND Gates, PW0014A; Generic Part Number: SN74HC00; Manufacturer: Texas Instruments; PartNumber: SN74HC00PW; VCC(Min)(V): 2; VCC(Max)(V): 6; Output Type: CMOS; ICC @ Nom Voltage(Max)(mA): 0.02; Bits(#): 4; F @ Nom Voltage(Max)(Mhz): 70; Technology Family: HC; Voltage(Nom)(V): 5; Schmitt Trigger: Yes; Output Drive (IOL/IOH)(Max)(mA): 5.2/-5.2; tpd @ Nom Voltage(Max)(ns): 23; PackageReference: PW0014A; Input Type: CMOS; Operating Temperature Range(C): -40 to 85
DD11 = 74HC08: Quad 2-Input Positive-NAND Gates, PW0014A; Generic Part Number: SN74HC00; Manufacturer: Texas Instruments; PartNumber: SN74HC08PW; VCC(Min)(V): 2; VCC(Max)(V): 6; Output Type: CMOS; ICC @ Nom Voltage(Max)(mA): 0.02; Bits(#): 4; F @ Nom Voltage(Max)(Mhz): 70; Technology Family: HC; Voltage(Nom)(V): 5; Schmitt Trigger: Yes; Output Drive (IOL/IOH)(Max)(mA): 5.2/-5.2; tpd @ Nom Voltage(Max)(ns): 23; PackageReference: PW0014A; Input Type: CMOS; Operating Temperature Range(C): -40 to 85
DD12 = SN74LVC1G00DBV: as DD2 on sheet 04_Debugging; PartNumber: SN74LVC1G00DBV
DD13 DD15 = SN74LVC1G08DBV: as DD6 on sheet 05_FOC_RS_Interface; PartNumber: SN74LVC1G08DBV
DD14 = SN74LVC1G32DBV: 2-in OR; Manufacturer: Texas Instruments; PartNumber: SN74LVC1G32DBV
F1 = MF-MSMF010 (0.1A 60VDC 15R): PTC Resettable Fusses 0.1A 60VDC 15R; Manufacturer: BOURNS; PartNumber: MF-MSMF010
F2 F3 = C250-400 (0.4A 250VAC 1.35R): PTC Resettable Fusses 0.4A 250VAC 1.35R; Manufacturer: SEA&LAND ELECTRONIC CORP.; PartNumber: C250-400
K1-K3 K6 = FTR-B4GA012Z: 250VAC 1A DPDT 12VDC; Manufacturer: Fujitsu; PartNumber: FTR-B4GA012Z
K4 K5 K7 = G2RL-24 DC12: 440VAC 8A DPDT 12VDC; Manufacturer: Omron; PartNumber: G2RL-24 DC12
L5 L8 = DLW5BSM302SQ2: SMD Common Mode Choke Coil 0.5A Z = 3000 Ohm / 100 MHz; Manufacturer: MURATA; PartNumber: DLW5BSM302SQ2
L6 L7 L9 = BLM21AG102SN1: 1000R 0.6A (100MHz); Manufacturer: TDK; Value: 1000R 0.6A (100MHz); PartNumber: BLM21AG102SN1
R42 R55 R62 R69 R71 R72 = R1206 1K 1%: SMD R 1206 VISHAY 0.25W 200V 1% 100ppm; PartNumber: CRCW12061K00FK; Manufacturer: VISHAY; Value: 1K
R43 R56 R65 = R0603 1K 1%: as R10 on sheet 03_PowerSupply; Manufacturer: VISHAY; Value: 1K
R44-R48 R50 R51 R53 R54 = R0603 100 1%: as R9 on sheet 03_PowerSupply; Manufacturer: VISHAY; Value: 100
R49 R52 R57 R58 R60 = R0603 10К 1%: as R5 on sheet 03_PowerSupply; Manufacturer: VISHAY; Value: 10K
R59 R61 R66 R67 = R0805 1K 1%: SMD R 0805 VISHAY 0.125W 150V 1% 100ppm; PartNumber: CRCW08051K00FK; Manufacturer: VISHAY; Value: 1K
R63 R64 = R1206 510 1%: SMD R 1206 VISHAY 0.25W 200V 1% 100ppm; PartNumber: CRCW1206510RFK; Manufacturer: VISHAY; Value: 510
R68 = R0805 1M 1%: SMD R 0805 VISHAY 0.125W 150V 1% 100ppm; PartNumber: CRCW08051M00FK; Manufacturer: VISHAY; Value: 1M
R70 = R0805 200K 1%: SMD R 0805 VISHAY 0.125W 150V 1% 100ppm; PartNumber: CRCW0805200KFK; Manufacturer: VISHAY; Value: 200K
VD9 VD13 VD16 VD19 VD21 VD23 = LL-S172GC-2A: LED Green SMD; Manufacturer: Lucky Light; PartNumber: LL-S172GC-2A
VD10 VD15 VD17 VD18 VD20 VD22 VD24 = PMLL4148: as VD2 on sheet 03_PowerSupply; PartNumber: PMLL4148
VD11 VD12 VD14 = SMAJ12CA: 400W 12V  Transient Voltage Suppressor, Bidirectional; Manufacturer: LITTELFUSE; PartNumber: SMAJ12CA
VT2 VT3 VT5 VT6 VT8 = PDTC114ET: Digital Transistor (BRT), R1=10 kOhm, R2=10 kOhm, NPN Transistor; Manufacturer: On Semiconductor; PartNumber: PDTC114ET
VT4 VT7 = BC817: NPN Silicon, 3-Pin SOT-23; Manufacturer: NXP; PartNumber: BC817
X7 X9 = 35362-0350: Sherlock 3 Top, 2A 125V 2mm; Manufacturer: MOLEX; PartNumber: 35362-0350
X8 X10 = 35362-0450: Sherlock 4 Top, 2A 125V 2mm; Manufacturer: MOLEX; PartNumber: 35362-0450
X11 = B04P-NV: NV 4 конт LS=5.0 10A 250V PCB; Manufacturer: JST; PartNumber: B04P-NV
X12 = B02P-NV: NV 2 LS=5.0 10A 250V PCB; Manufacturer: JST; PartNumber: B02P-NV

## Sheet 07_EEPR_DISCHAR.SchDoc
size A4; Organization: OLTEST; Revision: 01; SheetNumber: 07; SheetTotal: 13; Название листа: Название листа; Разработчик: Бондарчук С.; Прибор: R100; АМАК.000000.000 Э3: R100.230.030.000-00; Дата: 16.04.2019; Формат: A4; WorkSpaceName: R100_Boards_v1
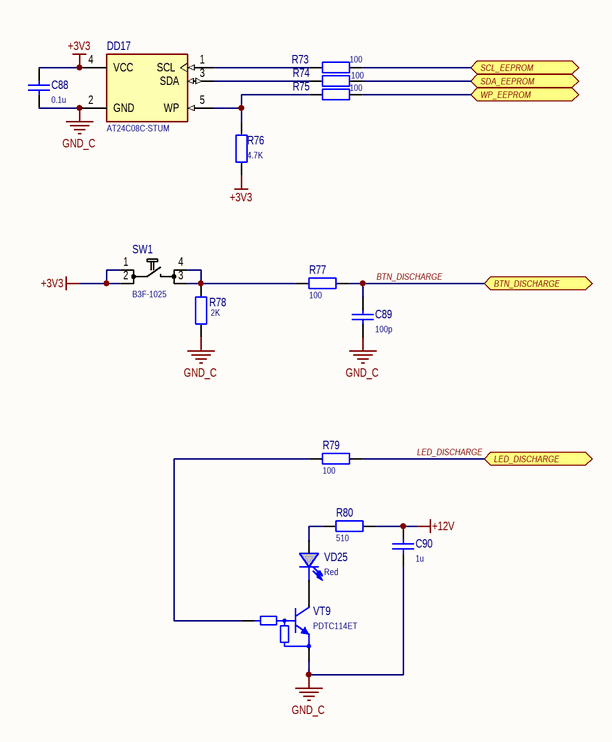
[diagram p6: 07_EEPR_DISCHAR.SchDoc]

### Parts
C88  0.1u  [SMD_C_0603]
C89  100p  [SMD_C_0603]
C90  1u  [SMD_C_0603]
DD17  AT24C08C-STUM  [5TS1]
R73  100  [SMD_R_0603]
R74  100  [SMD_R_0603]
R75  100  [SMD_R_0603]
R76  4.7K  [SMD_R_0805]
R77  100  [SMD_R_0603]
R78  2K  [SMD_R_0805]
R79  100  [SMD_R_0603]
R80  510  [SMD_R_1206]
SW1  B3F-1025  [B3F-1025 (no gnd)]
VD25  value Red  [SMD_LED_LL_Red]  (hidden comment: LL-S172SC-2S)
VT9  PDTC114ET  [SOT23-3]

### Ports
BTN_DISCHARGE, LED_DISCHARGE, SCL_EEPROM, SDA_EEPROM, WP_EEPROM

### Nets
+3V3: C88.2 DD17.4(VCC) R76.1 SW1.1 SW1.2
+12V: C90.2 R80.2
GND_C: C88.1 C89.1 C90.1 DD17.2(GND) R78.1 VT9.2(E)
BTN_DISCHARGE: C89.2 R77.2 ; port BTN_DISCHARGE
LED_DISCHARGE: R79.2 ; port LED_DISCHARGE
SCL_EEPROM: R73.2 ; port SCL_EEPROM
SDA_EEPROM: R74.2 ; port SDA_EEPROM
WP_EEPROM: R75.2 ; port WP_EEPROM
NetDD17_1: DD17.1(SCL) R73.1
NetDD17_3: DD17.3(SDA) R74.1
NetDD17_5: DD17.5(WP) R75.1 R76.2
NetR77_1: R77.1 R78.2 SW1.3 SW1.4
NetR79_1: R79.1 VT9.1(B)
NetR80_1: R80.1 VD25.1(ANODE)
NetVD25_2: VD25.2(CATHODE) VT9.3(C)

### Notes on the sheet
- Разработчик:
- Формат:
- Rev.:
- Лист
- Дата:
- Листов
- WorkSpace:
- Дата изм.:

### Library data of the parts
C88 = C0603 0.1u 50V 10%: as C4 on sheet 02_MCU; Manufacturer: MURATA; Value: 0.1u
C89 = C0603 100p 100V 5%: as C36 on sheet 04_Debugging; Manufacturer: MURATA; Value: 100p
C90 = C0603 1uF 25V 10%: as C13 on sheet 02_MCU; Manufacturer: MURATA; Value: 1u
DD17 = AT24C08C-STUM: I2C Serial EEPROM, 8-Kbit (1024 x 8); PartNumber: AT24C08C-STUM-T; Manufacturer: ATMEL; ComponentLink1Description: Datasheet; ComponentLink1URL: \\NAS1\DataSheet\9589\AT24C08C.pdf
R73-R75 R77 R79 = R0603 100 1%: as R9 on sheet 03_PowerSupply; Manufacturer: VISHAY; Value: 100
R76 = R0805 4.7K 1%: as R16 on sheet 04_Debugging; Manufacturer: VISHAY; Value: 4.7K
R78 = R0805 2K 1%: SMD R 0805 VISHAY 0.125W 150V 1% 100ppm; PartNumber: CRCW08052K00FK; Manufacturer: VISHAY; Value: 2K
R80 = R1206 510 1%: as R63 on sheet 06_PowerRele_OnOff; Manufacturer: VISHAY; Value: 510
SW1 = B3F-1025: 1-50mA; 5-24V; 6x6mm h=5mm; Red; Manufacturer: Omron; PartNumber: B3F-1025
VD25 = LL-S172SC-2S: LED Red SMD; Manufacturer: Lucky Light; PartNumber: LL-S172SC-2S
VT9 = PDTC114ET: as VT2 on sheet 06_PowerRele_OnOff; PartNumber: PDTC114ET